# EasyEDA Pro project ProProject_Open Energy Box_2024-07-22.epro, schematic Schematic, sheets 1 to 7 of 12

## Sheets
1 CM4: Create Date: 2024-05-25; Page Name: CM4; Project Name: Open Energy Box; Schematic Name: Schematic; Update Date: 2024-05-25; Company: Connect IQ; Drawed: Rafal Pernal; Page Size: A4; Part Number: JLCPCB-002; Reviewed: EasyEDA Pro; Version: V0.1
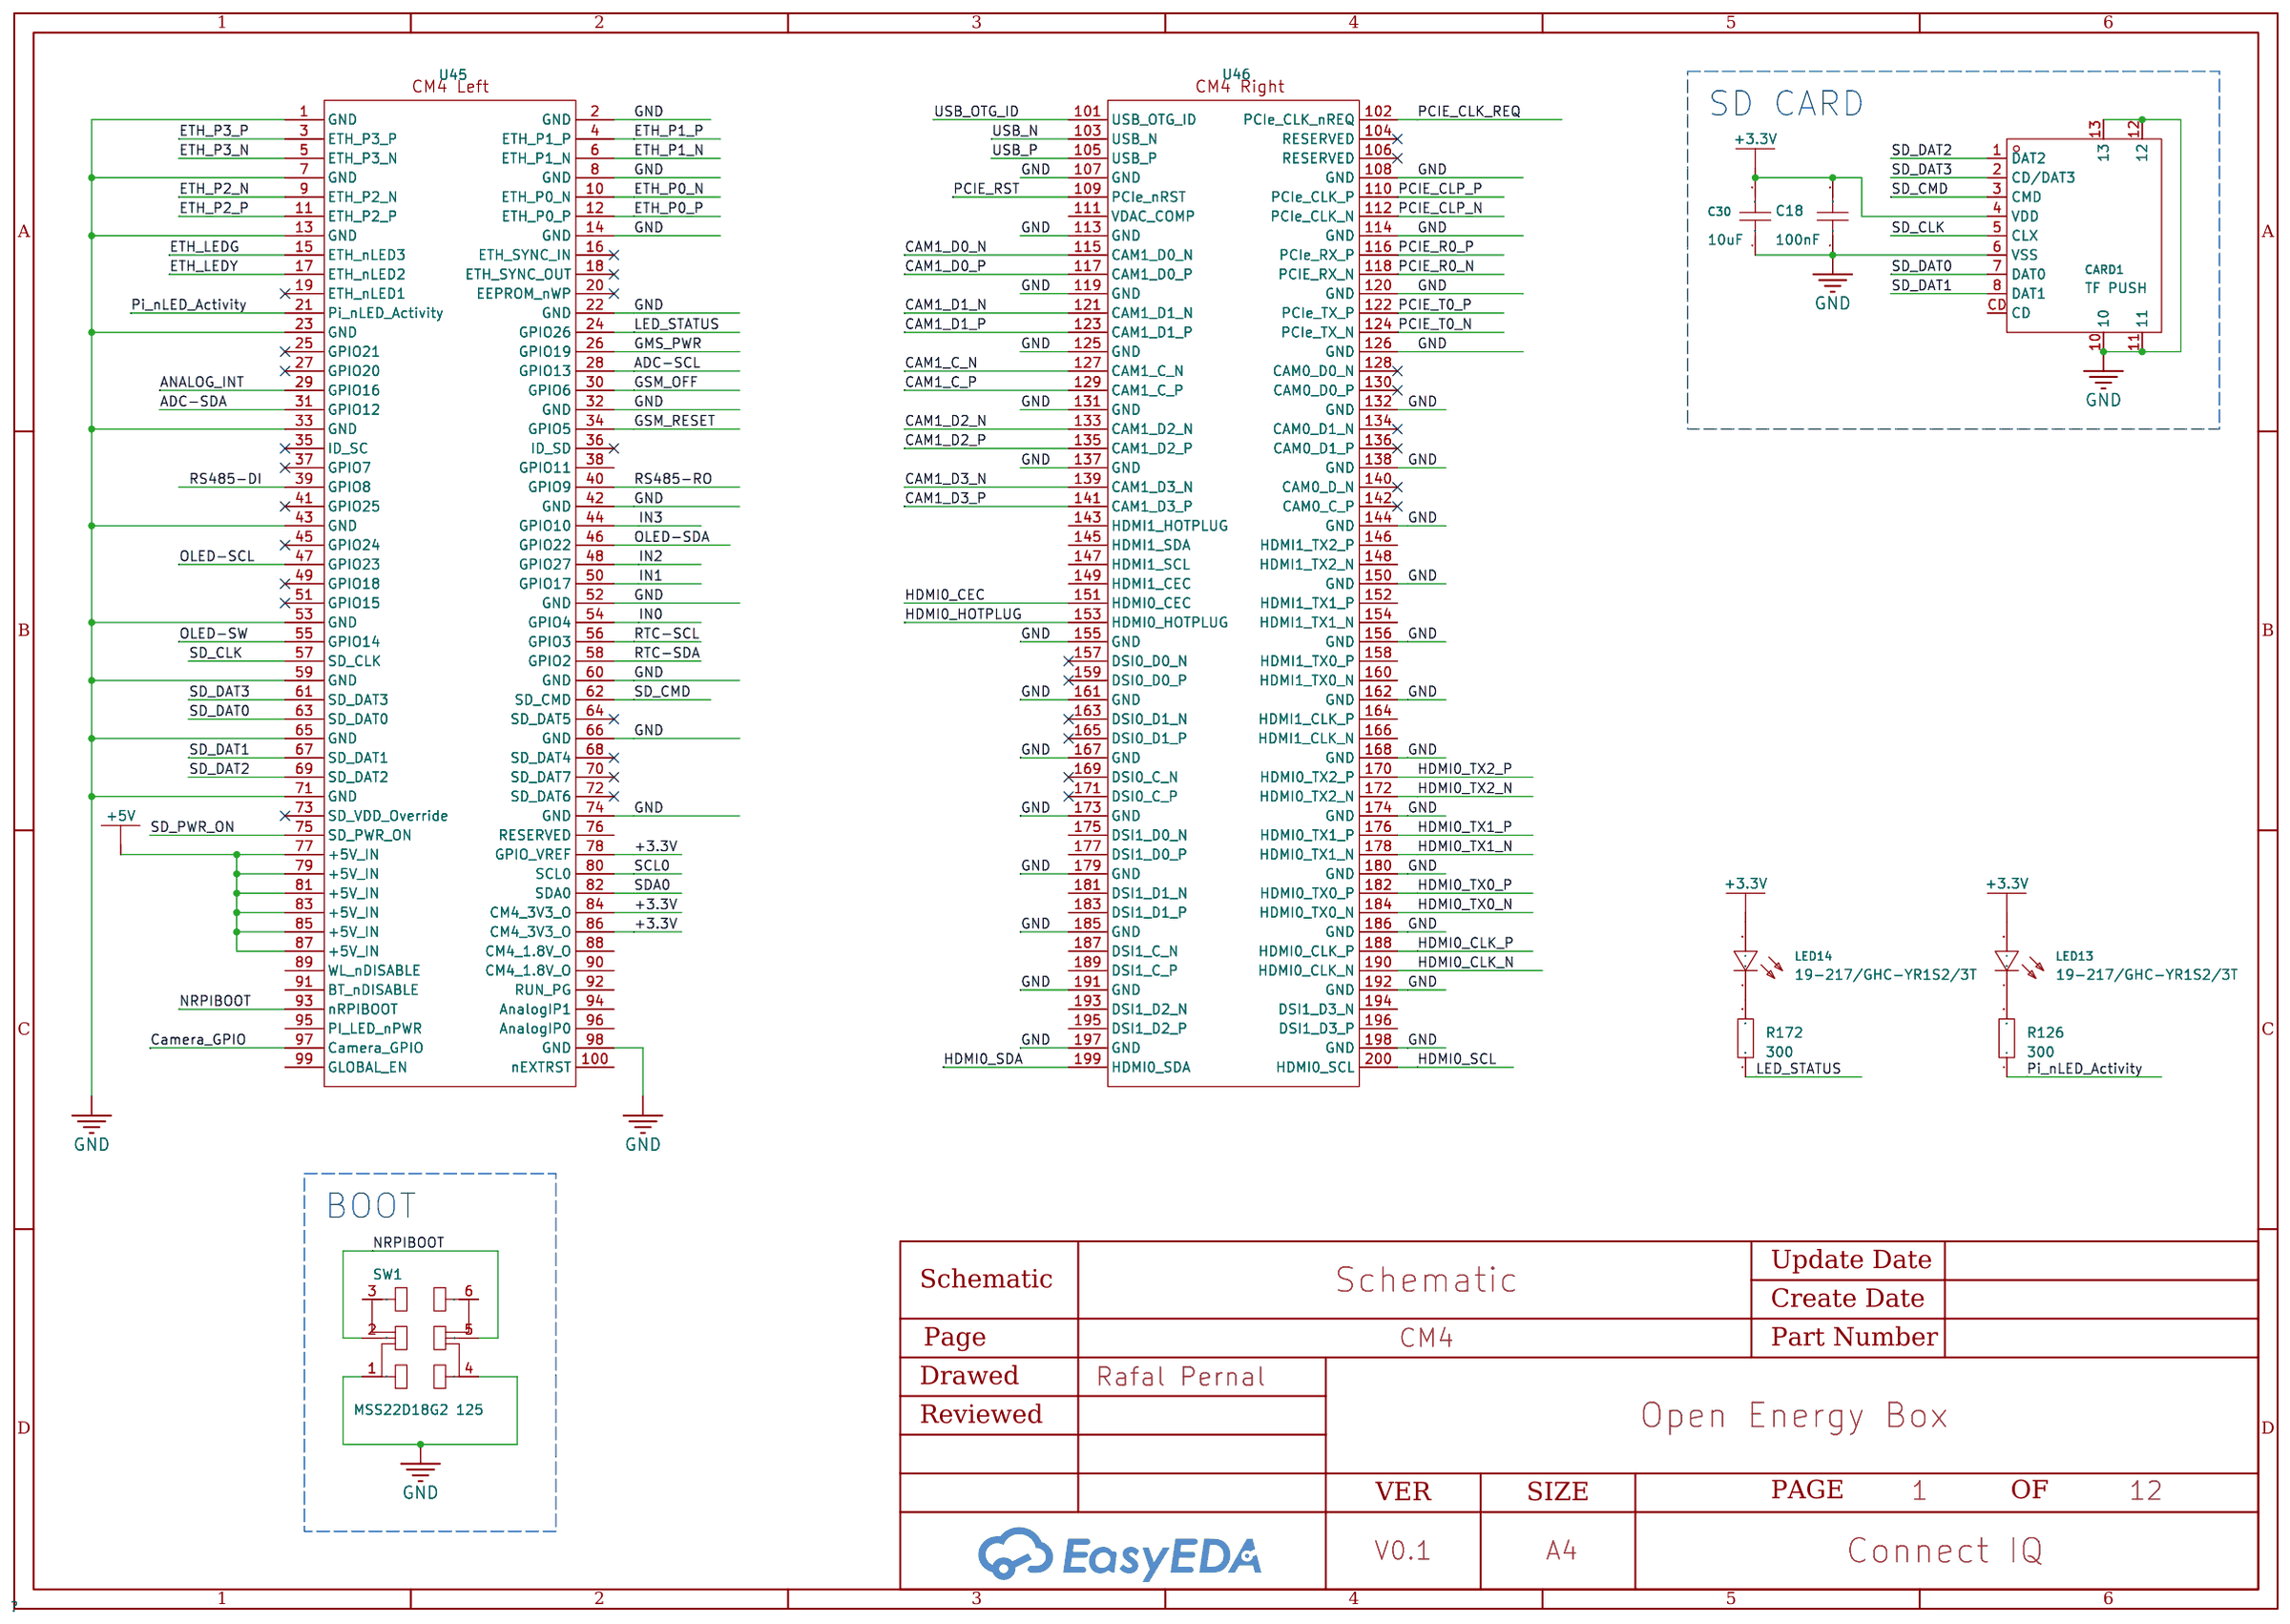
[diagram p0: CM4]
2 GSM: Page Name: GSM
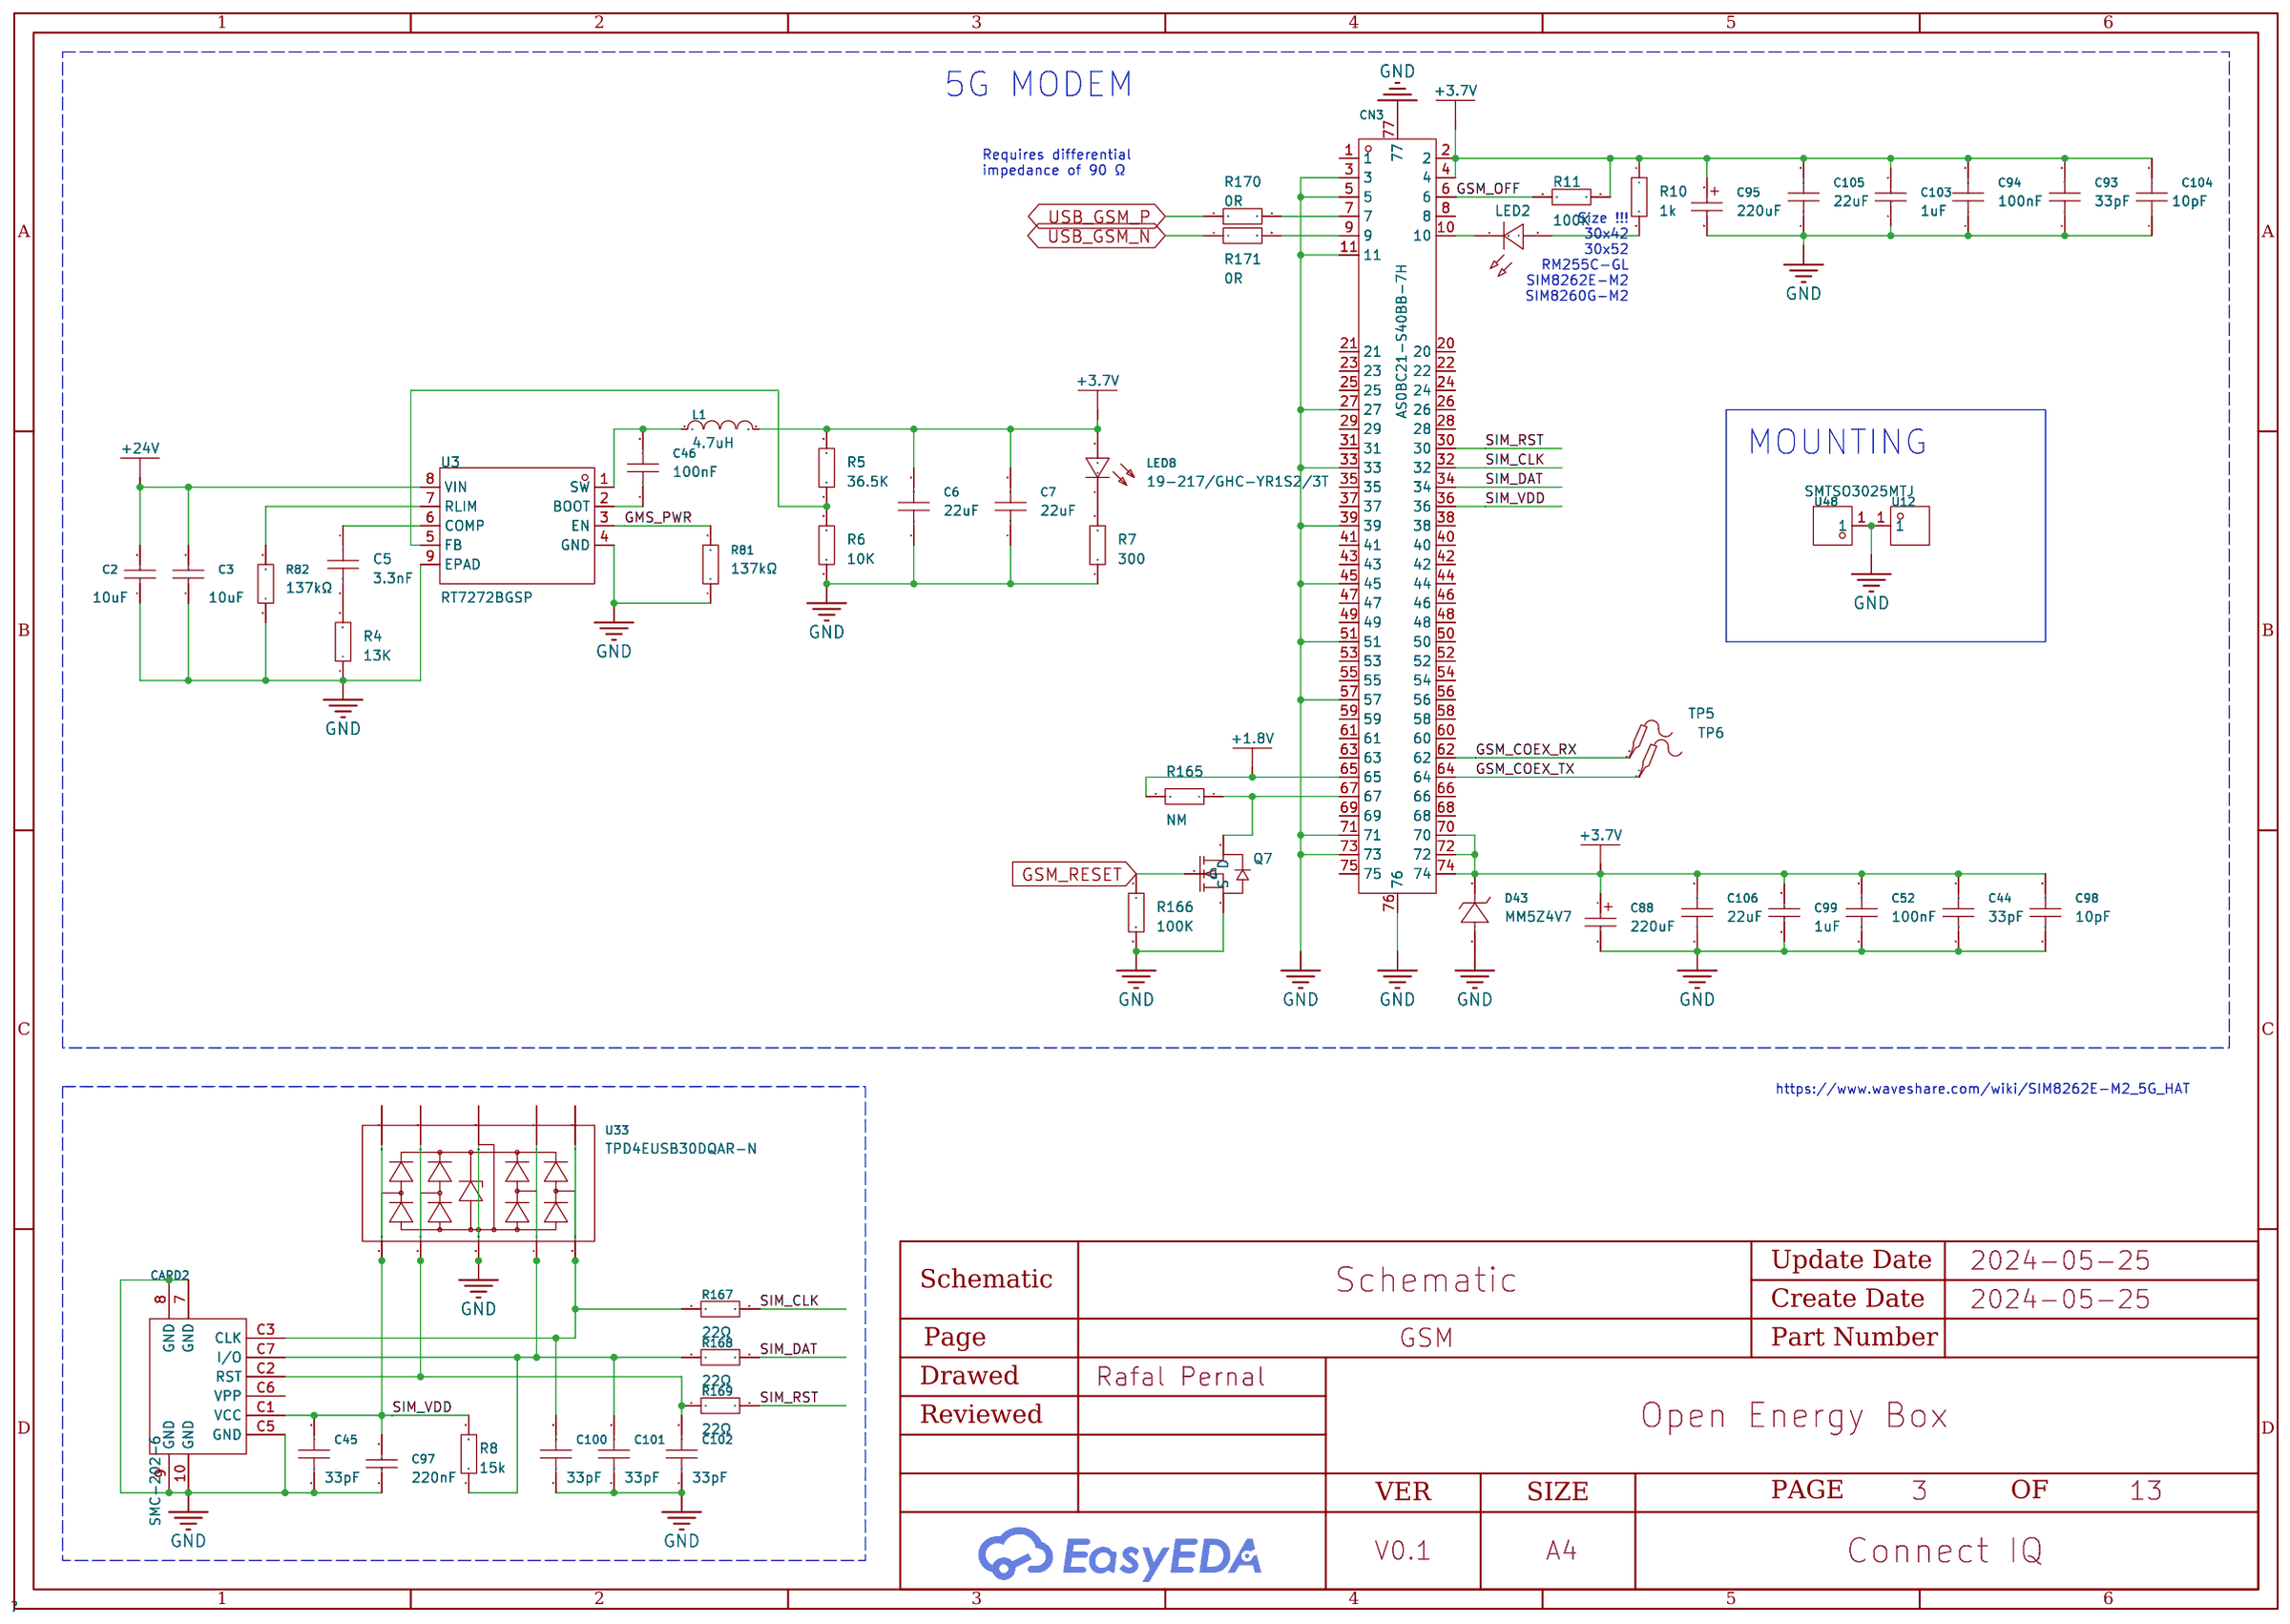
[diagram p1: GSM]
3 SSD: Page Name: SSD
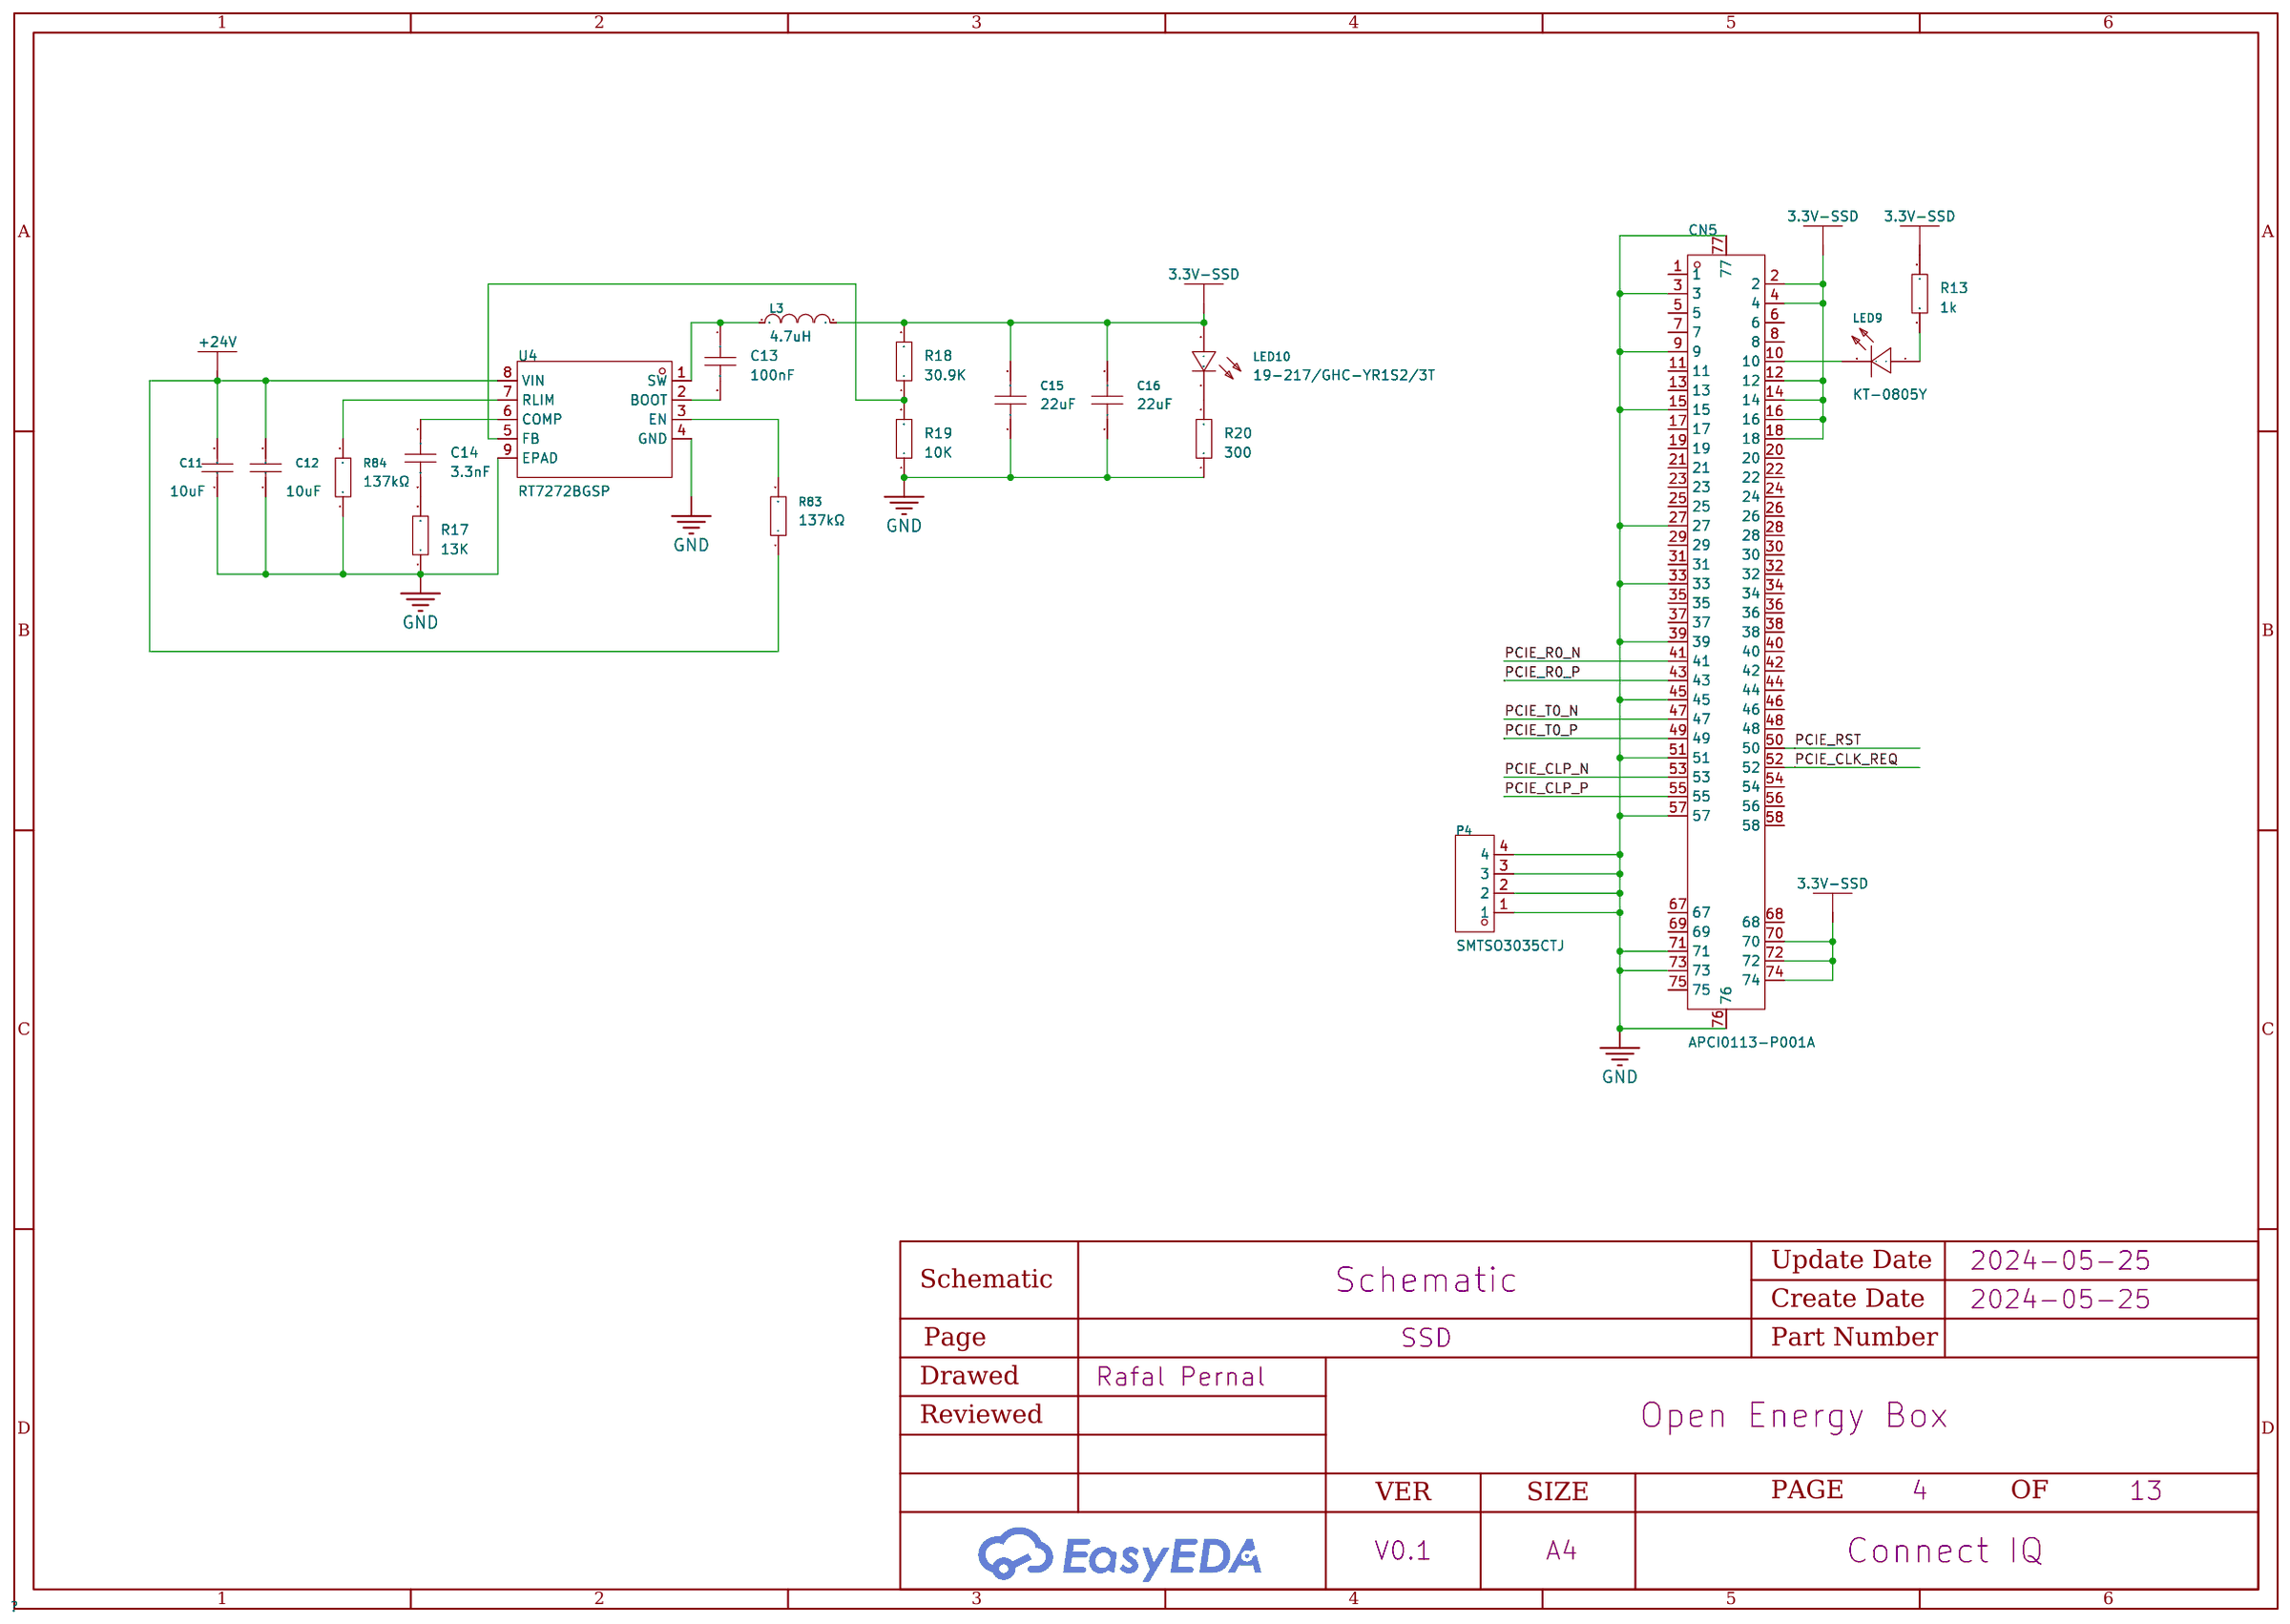
[diagram p2: SSD]
4 CAM_DIS: Page Name: CAM_DIS
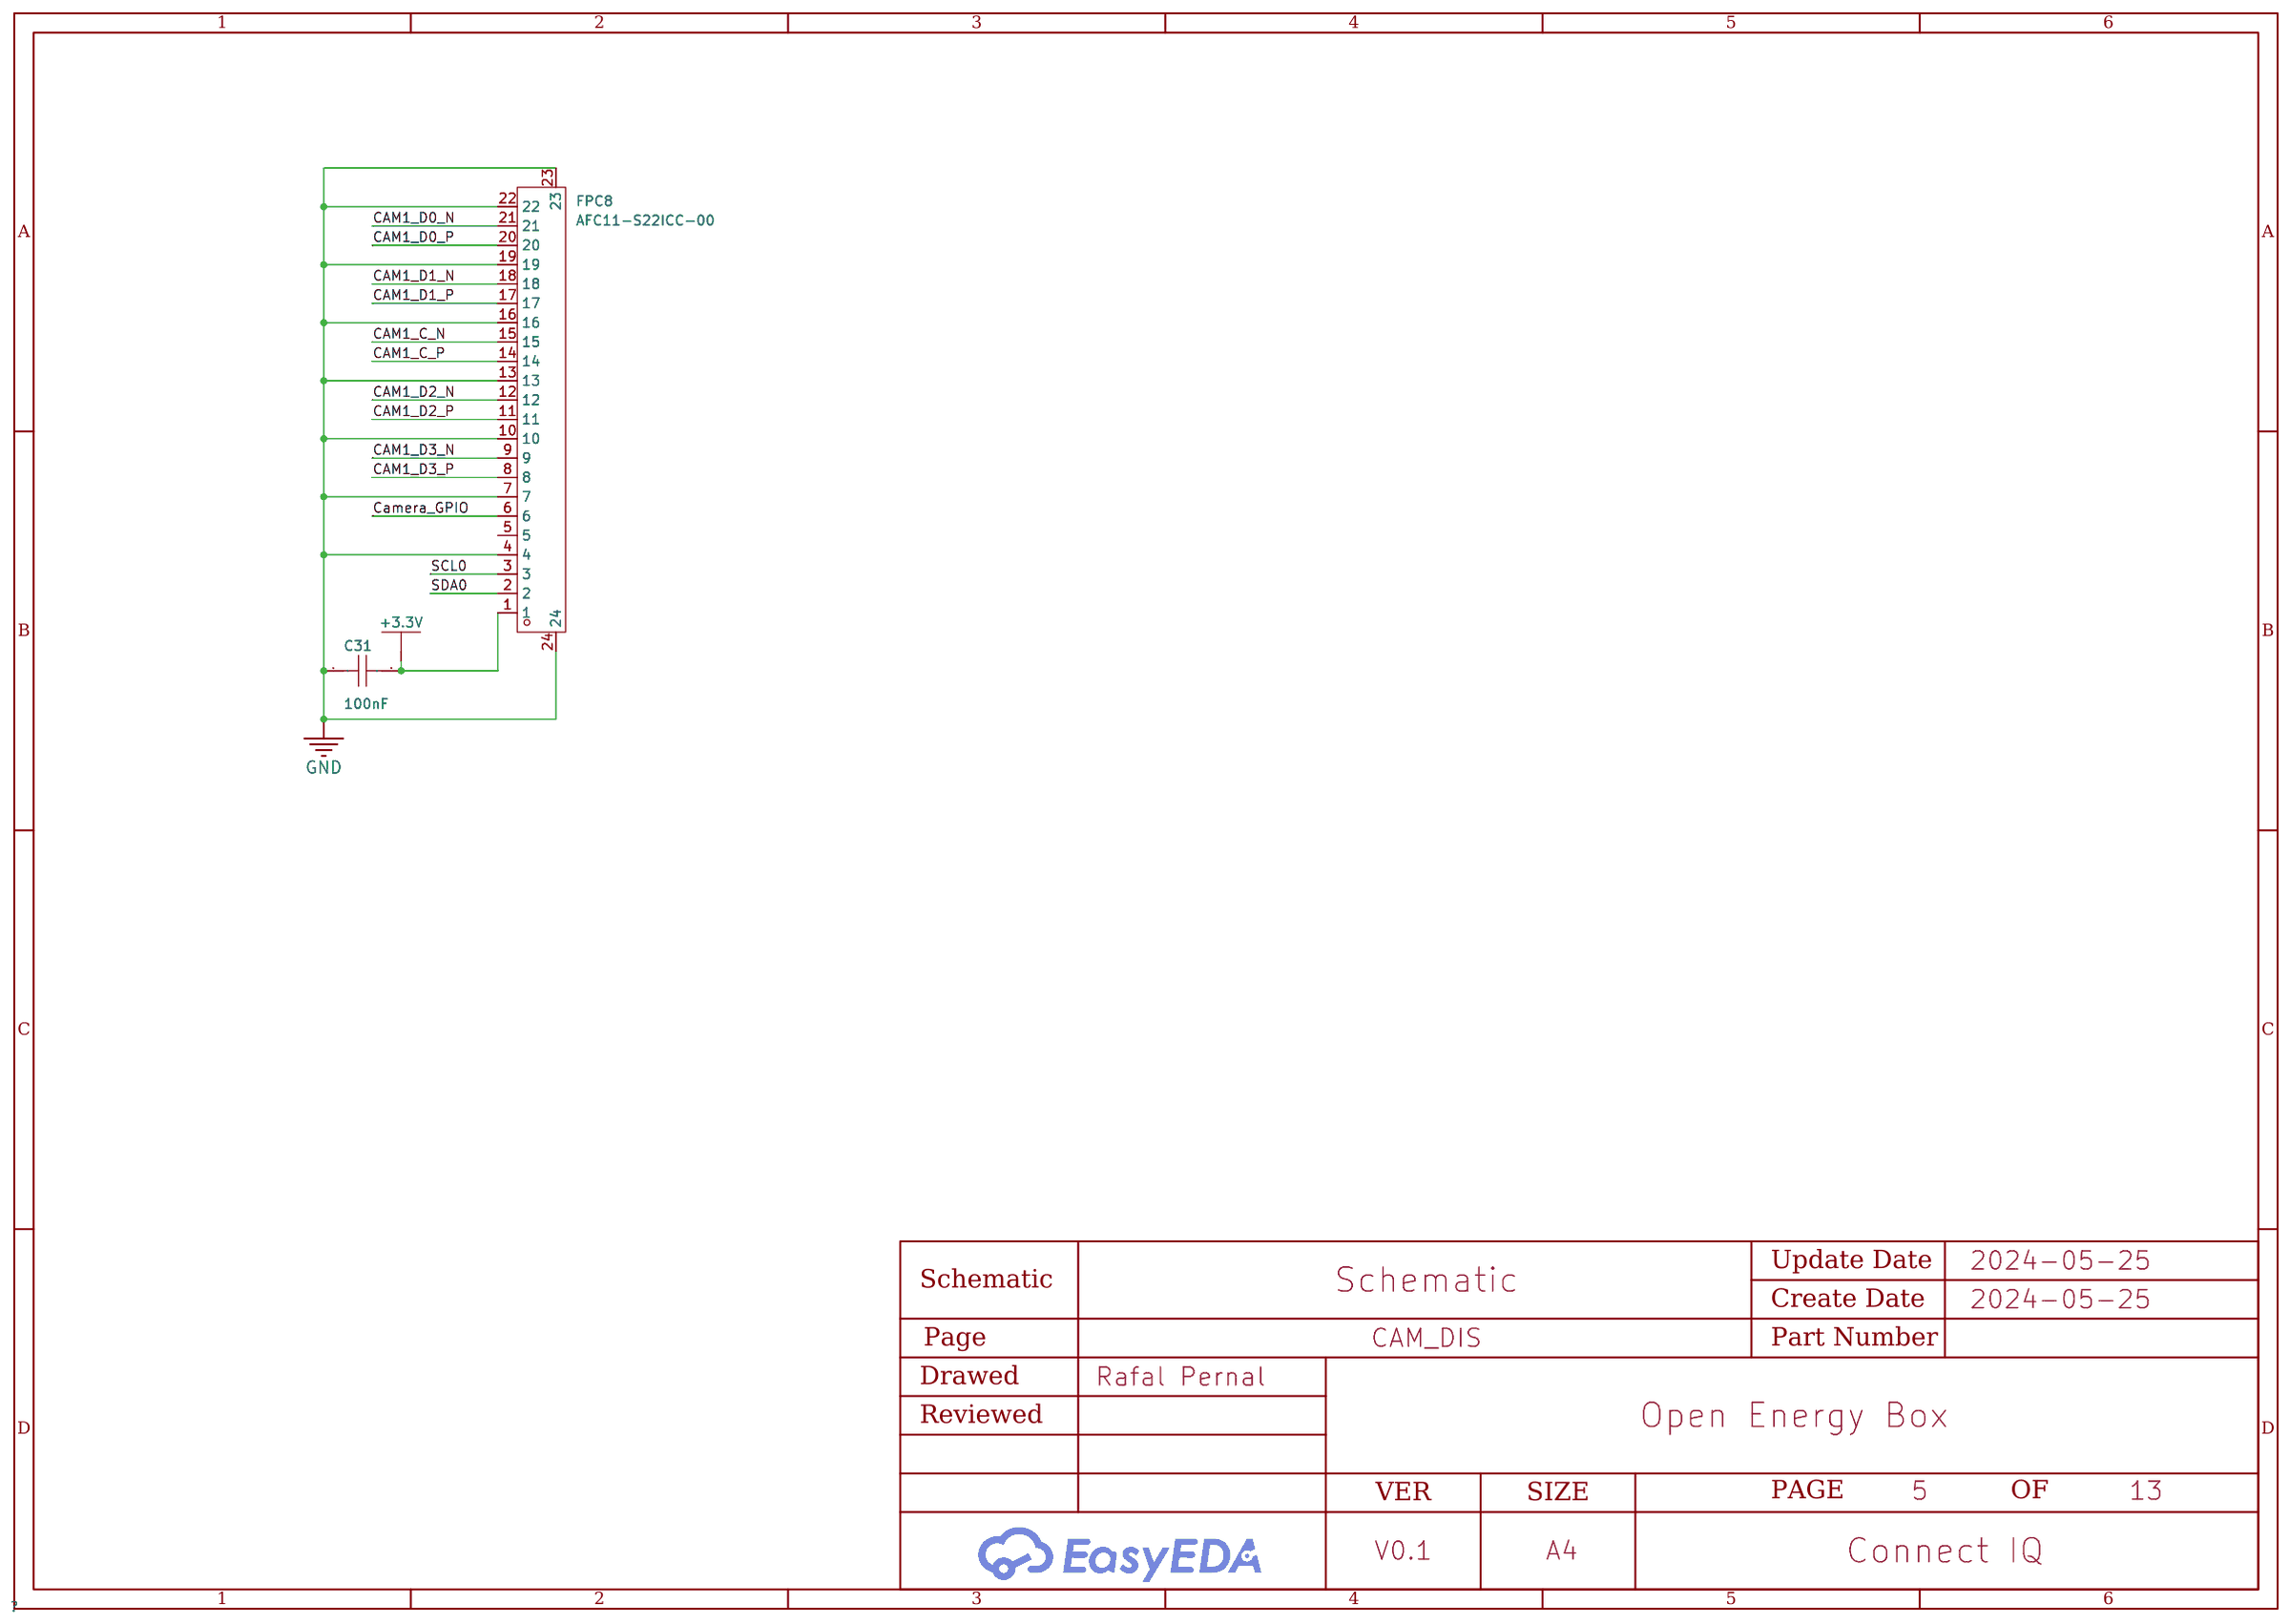
[diagram p3: CAM_DIS]
5 ANALOG: Page Name: ANALOG; Drawed: EasyEDA Pro
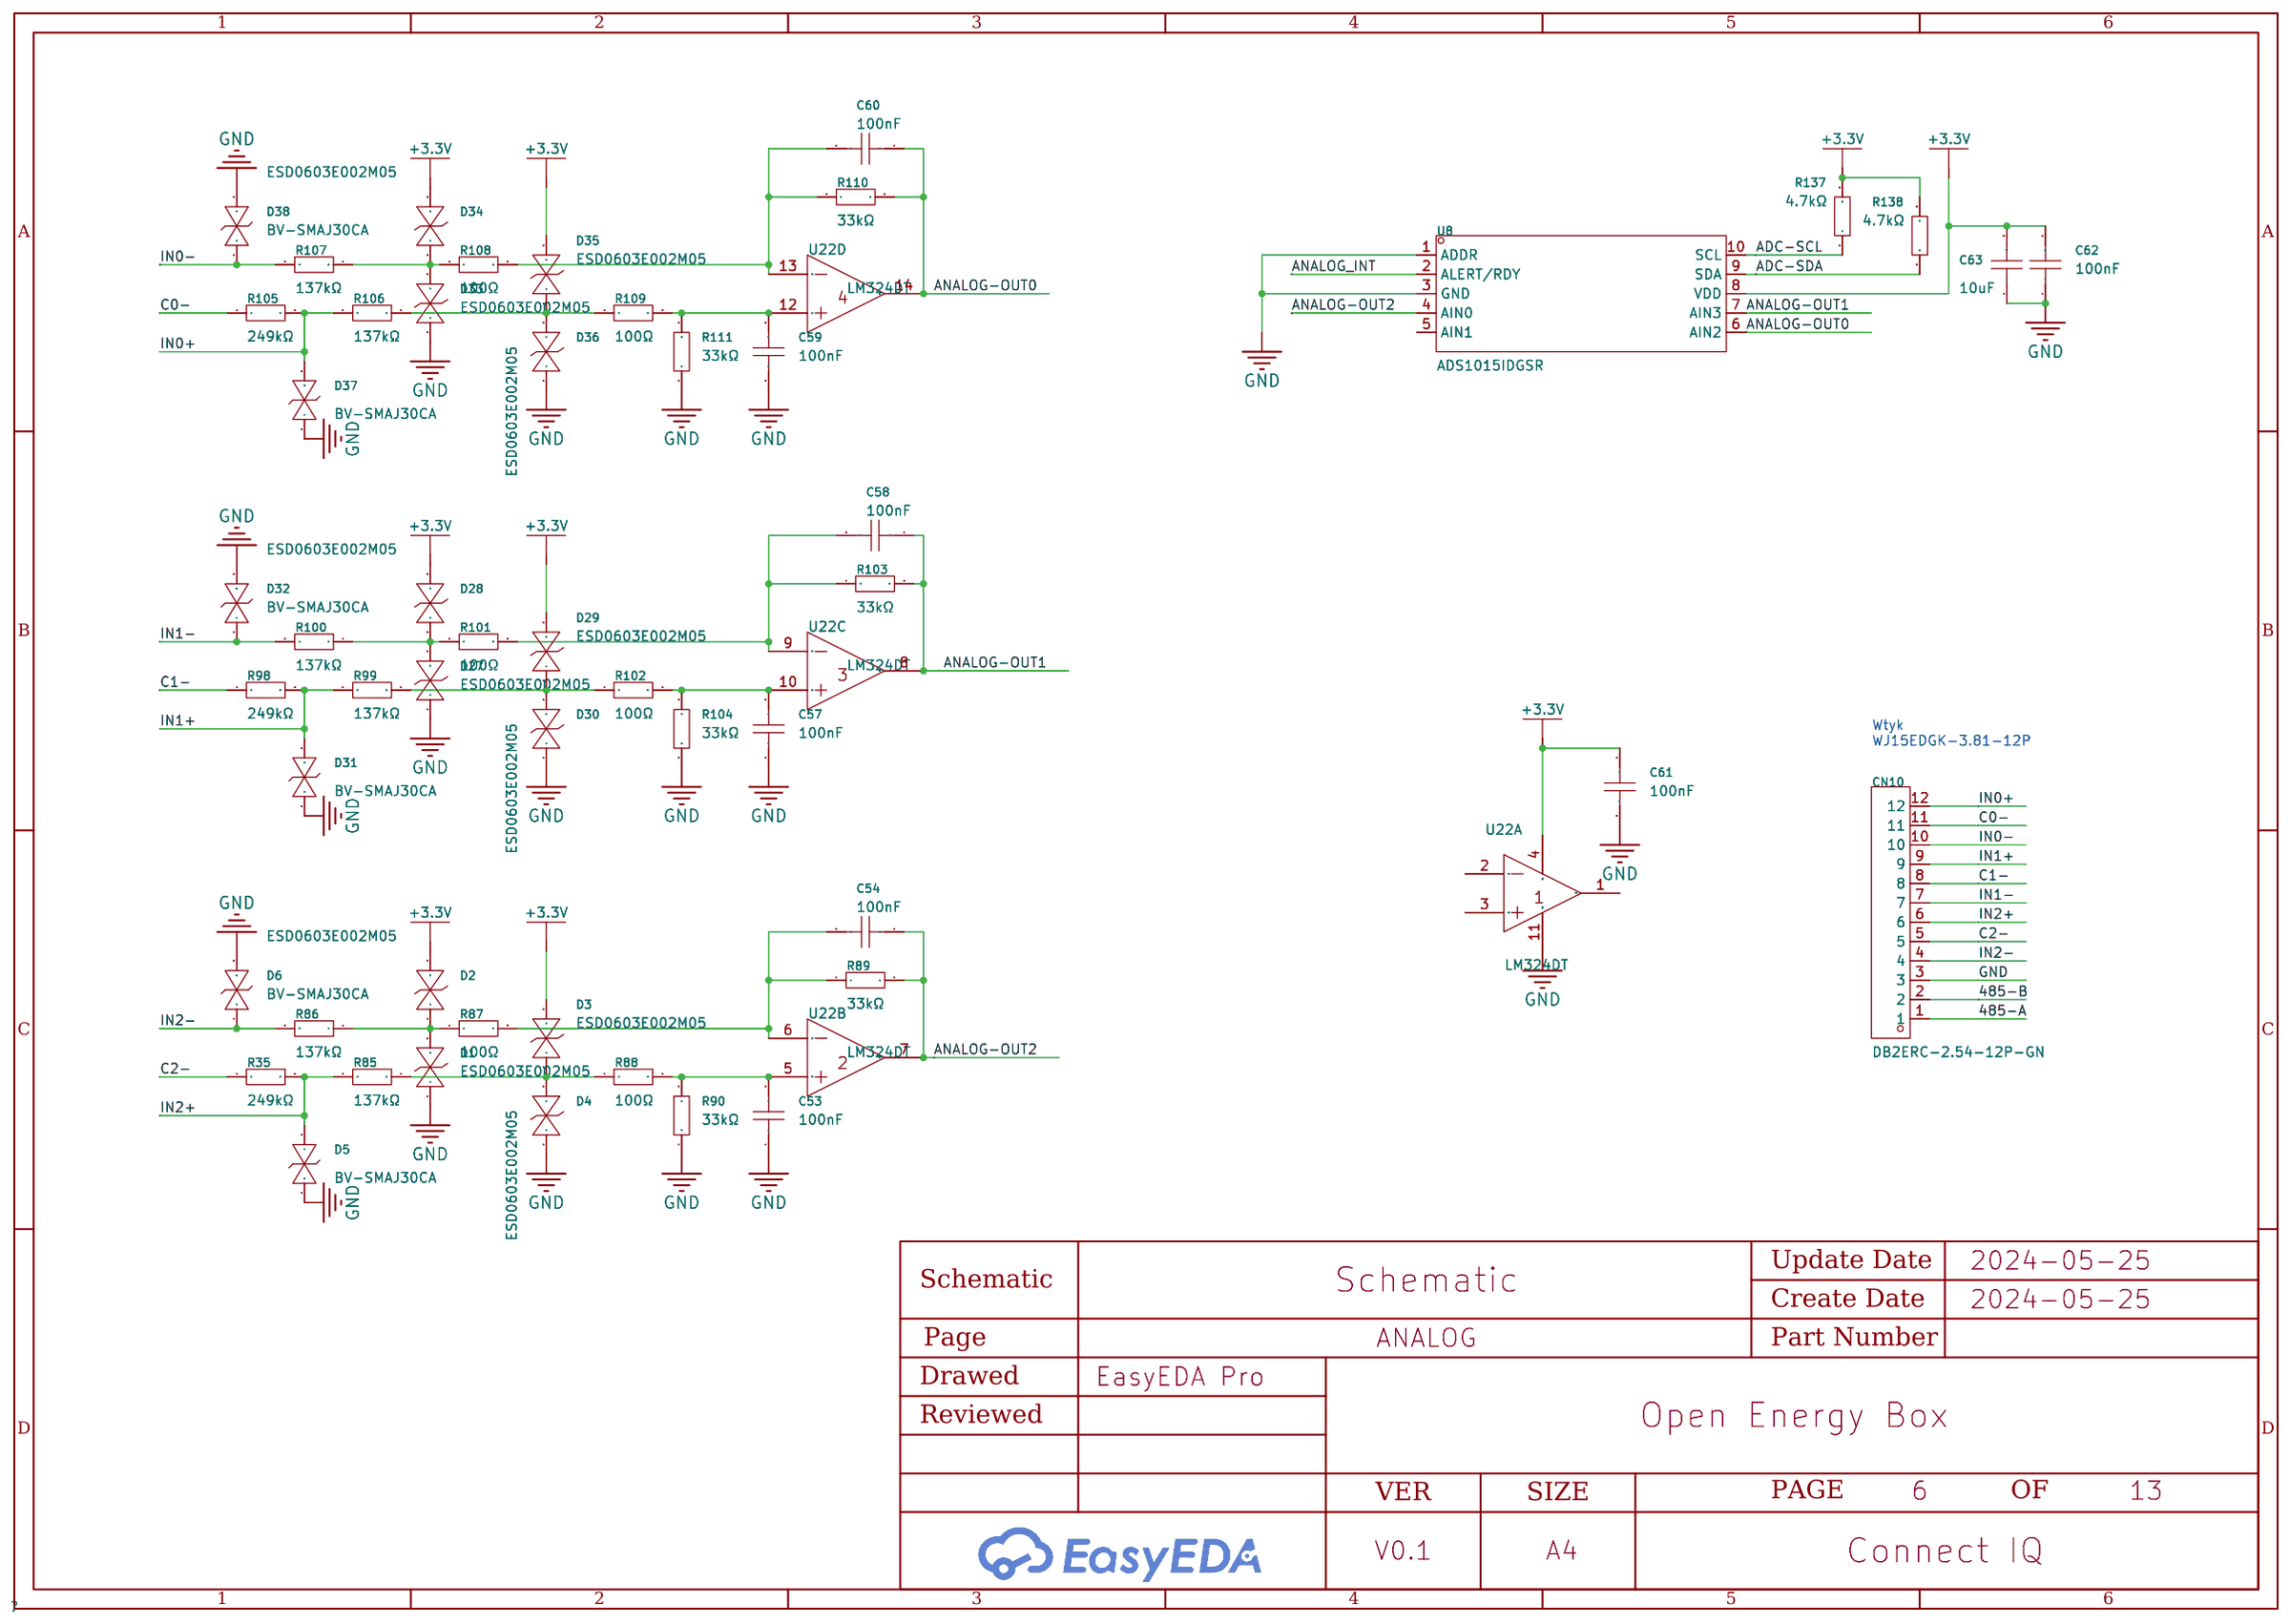
[diagram p4: ANALOG]
6 INPUTS: Page Name: INPUTS
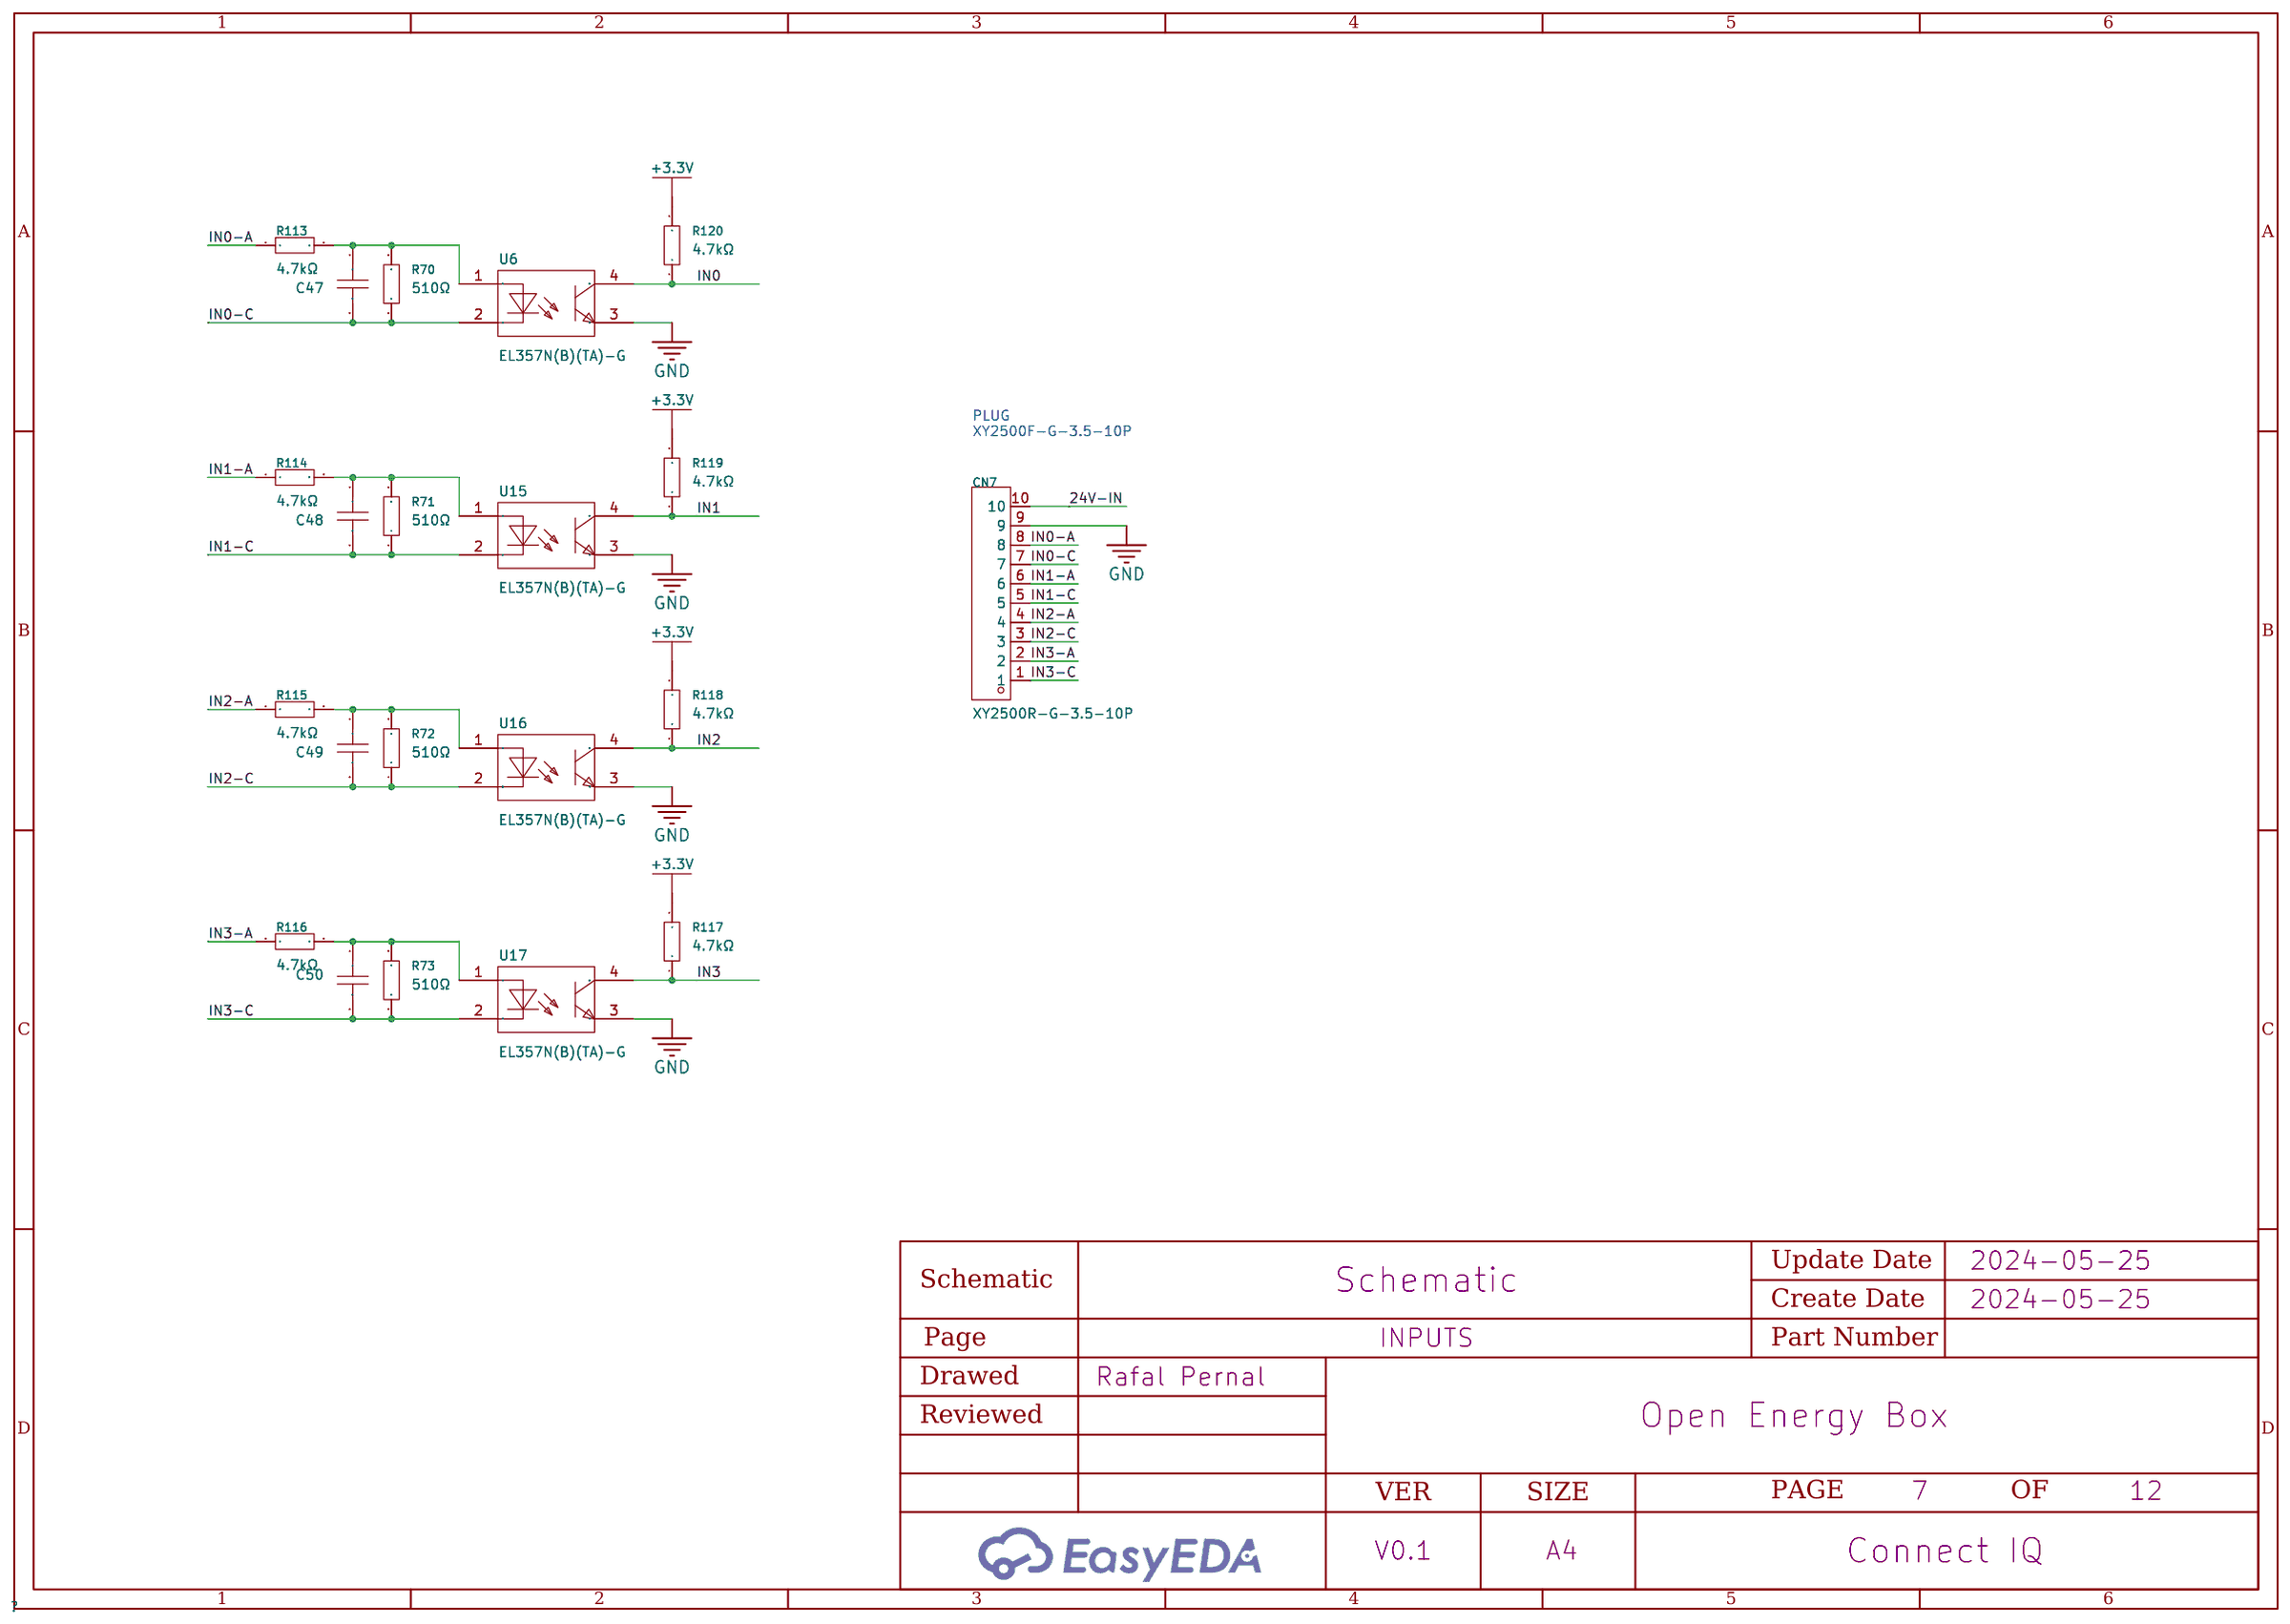
[diagram p5: INPUTS]
7 USB: Page Name: USB
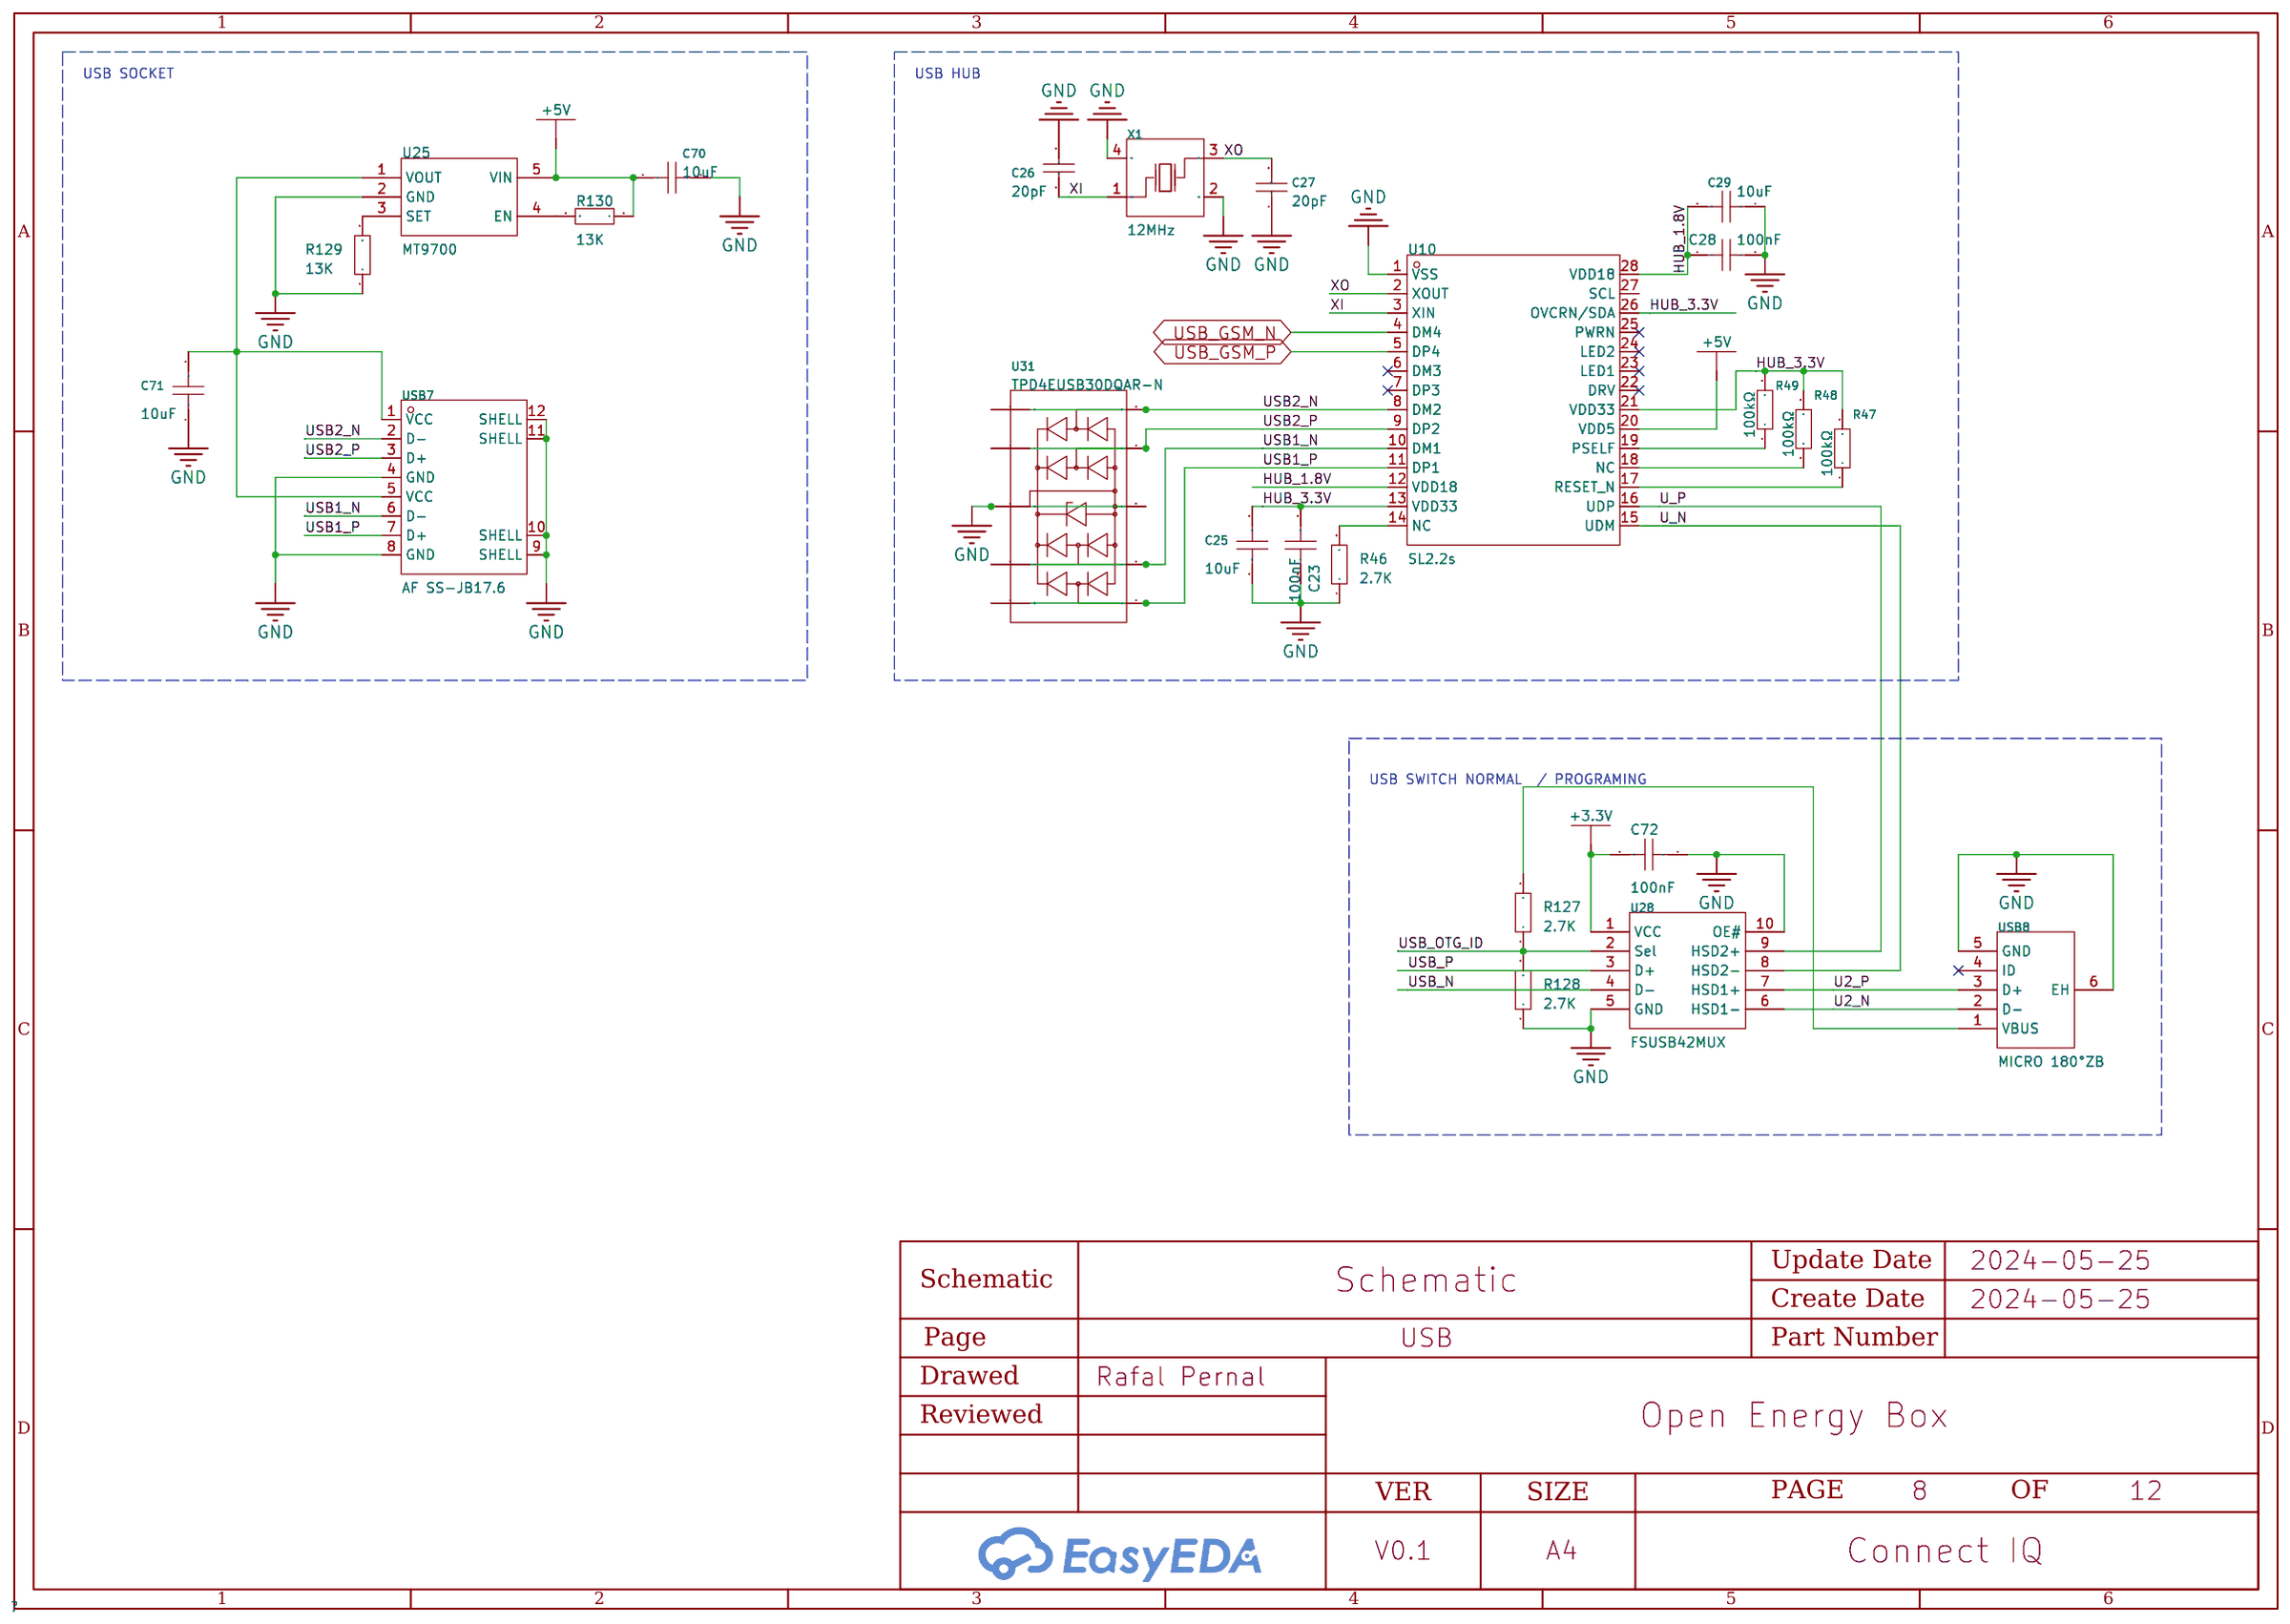
[diagram p6: USB]

## Parts
sheet ANALOG
C53  100nF  [C0603]
C54  100nF  [C0603]
C57  100nF  [C0603]
C58  100nF  [C0603]
C59  100nF  [C0603]
C60  100nF  [C0603]
C61  100nF  [C0603]
C62  100nF  [C0603]
C63  10uF  [C0603]
CN10  DB2ERC-2.54-12P-GN  [CONN-TH_12P-P2.54_DIBO_DB2ERC-2.54-12P-GN]
D1  ESD0603E002M05  [D0603-BI]
D2  ESD0603E002M05  [D0603-BI]
D3  ESD0603E002M05  [D0603-BI]
D4  ESD0603E002M05  [D0603-BI]
D5  BV-SMAJ30CA  [SMA_L4.4-W2.6-LS5.0-BI]
D6  BV-SMAJ30CA  [SMA_L4.4-W2.6-LS5.0-BI]
D27  ESD0603E002M05  [D0603-BI]
D28  ESD0603E002M05  [D0603-BI]
D29  ESD0603E002M05  [D0603-BI]
D30  ESD0603E002M05  [D0603-BI]
D31  BV-SMAJ30CA  [SMA_L4.4-W2.6-LS5.0-BI]
D32  BV-SMAJ30CA  [SMA_L4.4-W2.6-LS5.0-BI]
D33  ESD0603E002M05  [D0603-BI]
D34  ESD0603E002M05  [D0603-BI]
D35  ESD0603E002M05  [D0603-BI]
D36  ESD0603E002M05  [D0603-BI]
D37  BV-SMAJ30CA  [SMA_L4.4-W2.6-LS5.0-BI]
D38  BV-SMAJ30CA  [SMA_L4.4-W2.6-LS5.0-BI]
R35  249kΩ  [R1206]
R85  137kΩ  [R0603]
R86  137kΩ  [R0603]
R87  100Ω  [R0603]
R88  100Ω  [R0603]
R89  33kΩ  [R0603]
R90  33kΩ  [R0603]
R98  249kΩ  [R1206]
R99  137kΩ  [R0603]
R100  137kΩ  [R0603]
R101  100Ω  [R0603]
R102  100Ω  [R0603]
R103  33kΩ  [R0603]
R104  33kΩ  [R0603]
R105  249kΩ  [R1206]
R106  137kΩ  [R0603]
R107  137kΩ  [R0603]
R108  100Ω  [R0603]
R109  100Ω  [R0603]
R110  33kΩ  [R0603]
R111  33kΩ  [R0603]
R137  4.7kΩ  [R0603]
R138  4.7kΩ  [R0603]
U8  ADS1015IDGSR  [VSSOP-10_L3.0-W3.0-P0.50-LS4.9-BL]
U22  LM324DT  [SOIC-14_L8.7-W3.9-P1.27-LS6.0-BL]  (sections 1,2,3,4)
sheet CAM_DIS
C31  100nF  [C0603]
FPC8  AFC11-S22ICC-00  [FPC-SMD_22P-P1.00_AFC11-S22ICC-00]
sheet CM4
C18  100nF  [C0603]
C30  10uF  [C0603]
CARD1  TF PUSH  [TF-SMD_TF-PUSH]
LED13  19-217/GHC-YR1S2/3T  [LED0603-RD]
LED14  19-217/GHC-YR1S2/3T  [LED0603-RD]
R126  300  [R0603]
R172  300  [R0603]
SW1  MSS22D18G2 125  [SW-TH_SHOU_MSS22D18G2]
U45  CM4 Left  [CM4 LEFT]
U46  CM4 Right  [CM4 RIGHT]
sheet GSM
C2  10uF  [C1206]
C3  10uF  [C1206]
C5  3.3nF  [C0603]
C6  22uF  [C0805]
C7  22uF  [C0805]
C44  33pF  [C0603]
C45  33pF  [C0603]
C46  100nF  [C0603]
C52  100nF  [C0603]
C88  220uF  [CASE-B_3528]
C93  33pF  [C0603]
C94  100nF  [C0603]
C95  220uF  [CASE-B_3528]
C97  220nF  [C0603]
C98  10pF  [C0603]
C99  1uF  [C0603]
C100  33pF  [C0603]
C101  33pF  [C0603]
C102  33pF  [C0603]
C103  1uF  [C0603]
C104  10pF  [C0603]
C105  22uF  [C0805]
C106  22uF  [C0805]
CARD2  SMC-202-6  [SIM-SMD_SMC-202-6]
CN3  AS0BC21-S40BB-7H  [CONN-SMD_AS0BC21-S30BB-7H]
D43  MM5Z4V7  [SOD-523_L1.2-W0.8-LS1.6-FD]
L1  4.7uH  [IND-SMD_L7.1-W6.6]
LED2  -  [LED0603-R-RD]
LED8  19-217/GHC-YR1S2/3T  [LED0603-RD]
Q7  -  [SOT-23-3_L2.9-W1.3-P1.90-LS2.4-BR]
R4  13K  [R0603]
R5  36.5K  [R0603]
R6  10K  [R0603]
R7  300  [R0603]
R8  15k  [R0603]
R10  1k  [R0603]
R11  100K  [R0603]
R81  137kΩ  [R0603]
R82  137kΩ  [R0603]
R165  NM  [R0603]
R166  100K  [R0603]
R167  22Ω  [R0603]
R168  22Ω  [R0603]
R169  22Ω  [R0603]
R170  0R  [R0603]
R171  0R  [R0603]
TP5  -  [Test-Point-0.5mm]
TP6  -  [Test-Point-0.5mm]
U3  RT7272BGSP  [SOIC-8_L5.0-W4.0-P1.27-LS6.0-BL-EP2.0]
U12  SMTSO3025MTJ  [SMD_SMTSO3060CTJ]
U33  TPD4EUSB30DQAR-N  [DFN-10_L2.5-W1.0-P0.50-BL-A]
U48  SMTSO3025MTJ  [SMD_SMTSO3060CTJ]
sheet INPUTS
C47  100nF  [C0603]
C48  100nF  [C0603]
C49  100nF  [C0603]
C50  100nF  [C0603]
CN7  XY2500R-G-3.5-10P  [CONN-TH_XY2500R-G-3.5-10P]
R70  510Ω  [R0603]
R71  510Ω  [R0603]
R72  510Ω  [R0603]
R73  510Ω  [R0603]
R113  4.7kΩ  [R0603]
R114  4.7kΩ  [R0603]
R115  4.7kΩ  [R0603]
R116  4.7kΩ  [R0603]
R117  4.7kΩ  [R0603]
R118  4.7kΩ  [R0603]
R119  4.7kΩ  [R0603]
R120  4.7kΩ  [R0603]
U6  EL357N(B)(TA)-G  [OPTO-SMD-4_L4.4-W4.1-P2.54-LS7.0-TL]
U15  EL357N(B)(TA)-G  [OPTO-SMD-4_L4.4-W4.1-P2.54-LS7.0-TL]
U16  EL357N(B)(TA)-G  [OPTO-SMD-4_L4.4-W4.1-P2.54-LS7.0-TL]
U17  EL357N(B)(TA)-G  [OPTO-SMD-4_L4.4-W4.1-P2.54-LS7.0-TL]
sheet SSD
C11  10uF  [C1206]
C12  10uF  [C1206]
C13  100nF  [C0603]
C14  3.3nF  [C0603]
C15  22uF  [C0805]
C16  22uF  [C0805]
CN5  APCI0113-P001A  [CONN-SMD_APCI0113-P001A]
L3  4.7uH  [IND-SMD_L7.1-W6.6]
LED9  KT-0805Y  [LED0805-R-RD]
LED10  19-217/GHC-YR1S2/3T  [LED0603-RD]
P4  SMTSO3035CTJ  [SMD_BD5.6-D4.1]
R13  1k  [R0603]
R17  13K  [R0603]
R18  30.9K  [R0603]
R19  10K  [R0603]
R20  300  [R0603]
R83  137kΩ  [R0603]
R84  137kΩ  [R0603]
U4  RT7272BGSP  [SOIC-8_L5.0-W4.0-P1.27-LS6.0-BL-EP2.0]
sheet USB
C23  100nF  [C0603]
C25  10uF  [C0603]
C26  20pF  [C0603]
C27  20pF  [C0603]
C28  100nF  [C0603]
C29  10uF  [C0603]
C70  10uF  [C0603]
C71  10uF  [C0603]
C72  100nF  [C0603]
R46  2.7K  [R0603]
R47  100kΩ  [R0603]
R48  100kΩ  [R0603]
R49  100kΩ  [R0603]
R127  2.7K  [R0603]
R128  2.7K  [R0603]
R129  13K  [R0603]
R130  13K  [R0603]
U10  SL2.2s  [SSOP-28_L9.9-W3.9-P0.64-LS6.0-BL]
U25  MT9700  [SOT-23-5_L3.0-W1.7-P0.95-LS2.8-BR]
U28  FSUSB42MUX  [MSOP-10_L3.0-W3.0-P0.50-LS5.0-BL]
U31  TPD4EUSB30DQAR-N  [DFN-10_L2.5-W1.0-P0.50-BL-A]
USB7  AF SS-JB17.6  [USB-A-TH_AF-SS-JB17.6]
USB8  MICRO 180°ZB  [MICRO-USB-TH_MICRO-180-ZB]
X1  12MHz  [OSC-SMD_4P-L3.2-W2.5-BL]

## Library data of the parts
C44-C46 C52-C54 C57-C62 C93 C94 C98 C100-C102 C104 = CC0603KRX7R9BB104: Capacitance: Tolerance:±10% Tolerance:±10% Voltage Rated: Temperature Coefficient:; LCSC Part Name: 100nF ±10% 50V; Supplier Part: C14663; Manufacturer: YAGEO(国巨); Supplier Footprint: 0603; JLCPCB Part Class: Basic Part; Datasheet: https://atta.szlcsc.com/upload/public/pdf/source/20180910/C282072_33301C7F631E79921B82A8DAC6BCC5B3.pdf; Supplier: LCSC; Tolerance: ±10%
C25 C29 C30 C63 C70 C71 = CL10A106KP8NNNC: Capacitance: Tolerance:±10% Tolerance:±10% Voltage Rated: Temperature Coefficient:; LCSC Part Name: 10uF ±10% 10V; Supplier Part: C19702; Manufacturer: SAMSUNG(三星); Supplier Footprint: 0603; JLCPCB Part Class: Basic Part; Datasheet: https://atta.szlcsc.com/upload/public/pdf/source/20160218/1457707763339.pdf; Supplier: LCSC; Tolerance: ±10%
CN10 = DB2ERC-2.54-12P-GN: Connector Type:板端/Receptacle-Close Pitch:2.54mm Structure:1x12P Number of Rows:1 Number of PINs Per Row:12 Number of Pins:12P Current Rating (Max):5A Voltage Rating (Max):150V Contact Material:Copper Alloy Contact Plating:Tin Operating Temperature Range:-; LCSC Part Name: 2.54mm 1x12P 排数:1 每排P数:12; Supplier Part: C2927512; Manufacturer: DIBO(地博电气); Supplier Footprint: 弯插,P=2.54mm; JLCPCB Part Class: Extended Part; Datasheet: https://atta.szlcsc.com/upload/public/pdf/source/20230321/910C409D9BDC2B7494BE314CD29A7494.pdf; Supplier: LCSC; Connector Type: 板端/Receptacle-Close; Pitch: 2.54mm; Structure: 1x12P; Number of Rows: 1; Number of PINs Per Row: 12; Number of Pins: 12P; Current Rating (Max): 5A; Voltage Rating (Max): 150V; Contact Material: Copper Alloy; Contact Plating: Tin; Operating Temperature Range: -40℃~+105℃; Color: Green; Mounting Style: Bend
D1-D4 D27-D30 D33-D36 = ESD0603E002M05: Supplier Part: C727179; Manufacturer: TWGMC(台湾迪嘉); Supplier Footprint: 0603; JLCPCB Part Class: Extended Part; Datasheet: https://atta.szlcsc.com/upload/public/pdf/source/20200827/C727179_89543CBBA629D7A8E1F2B7FF70E0FB60.pdf; Supplier: LCSC
D5 D6 D31 D32 D37 D38 = BV-SMAJ30CA: Supplier Part: C883201; Manufacturer: Bencent(槟城); Supplier Footprint: SMA(DO-214AC); JLCPCB Part Class: Extended Part; Datasheet: https://atta.szlcsc.com/upload/public/pdf/source/20201016/C883201_1813CF94EA8180A7637B4007E3FADB07.pdf; Supplier: LCSC
R35 R98 R105 = RTT062493FTP: Type:Thick Film Resistors Resistance: Tolerance:±1% Tolerance:±1% Power(Watts): Overload Voltage (Max): Temperature Coefficient:±100ppm/℃ Temperature Coefficient:±100ppm/℃ Operating Temperature Range:-55℃~+155℃ Operating Temperature Range:-55℃~+155℃; LCSC Part Name: 厚膜电阻 249kΩ ±1% 250mW; Supplier Part: C104719; Manufacturer: RALEC(旺诠); Supplier Footprint: 1206; JLCPCB Part Class: Extended Part; Datasheet: https://atta.szlcsc.com/upload/public/pdf/source/20191219/C158410_884373A5B7E1BC76BF57BC45A946C093.pdf; Supplier: LCSC; Type: Thick Film Resistors; Tolerance: ±1%; Temperature Coefficient: ±100ppm/℃; Operating Temperature Range: -55℃~+155℃
R81-R86 R99 R100 R106 R107 = 0603WAF1373T5E: Resistance:137000Ω Tolerance:±1% Tolerance:±1% Power(Watts): Overload Voltage (Max): Temperature Coefficient:±100ppm/℃ Temperature Coefficient:±100ppm/℃ Type:Thick Film Resistors Operating Temperature Range:-55℃~+155℃ Operating Temperature Range:-55℃~+155; LCSC Part Name: 137kΩ ±1% 100mW 厚膜电阻; Supplier Part: C22872; Manufacturer: UNI-ROYAL(厚声); Supplier Footprint: 0603; JLCPCB Part Class: Extended Part; Datasheet: https://atta.szlcsc.com/upload/public/pdf/source/20200306/C422600_1E6D84923E4A46A82E41ADD87F860B5C.pdf; Supplier: LCSC; Tolerance: ±1%; Temperature Coefficient: ±100ppm/℃; Type: Thick Film Resistors; Operating Temperature Range: -55℃~+155℃
R87 R88 R101 R102 R108 R109 = 0603WAF1000T5E: Resistance: Tolerance:±1% Tolerance:±1% Power(Watts): Overload Voltage (Max): Temperature Coefficient:±200ppm/℃ Temperature Coefficient:±200ppm/℃ Type:Thick Film Resistors Operating Temperature Range:-55℃~+155℃ Operating Temperature Range:-55℃~+155℃; LCSC Part Name: 100Ω ±1% 100mW 厚膜电阻; Supplier Part: C22775; Manufacturer: UNI-ROYAL(厚声); Supplier Footprint: 0603; JLCPCB Part Class: Basic Part; Datasheet: https://atta.szlcsc.com/upload/public/pdf/source/20200306/C422600_1E6D84923E4A46A82E41ADD87F860B5C.pdf; Supplier: LCSC; Tolerance: ±1%; Temperature Coefficient: ±200ppm/℃; Type: Thick Film Resistors; Operating Temperature Range: -55℃~+155℃
R89 R90 R103 R104 R110 R111 = 0603WAF3302T5E: Resistance:33000Ω Tolerance:±1% Tolerance:±1% Power(Watts): Overload Voltage (Max): Temperature Coefficient:±100ppm/℃ Temperature Coefficient:±100ppm/℃ Type:Thick Film Resistors Operating Temperature Range:-55℃~+155℃ Operating Temperature Range:-55℃~+155℃; LCSC Part Name: 33kΩ ±1% 100mW 厚膜电阻; Supplier Part: C4216; Manufacturer: UNI-ROYAL(厚声); Supplier Footprint: 0603; JLCPCB Part Class: Basic Part; Datasheet: https://atta.szlcsc.com/upload/public/pdf/source/20200306/C422600_1E6D84923E4A46A82E41ADD87F860B5C.pdf; Supplier: LCSC; Tolerance: ±1%; Temperature Coefficient: ±100ppm/℃; Type: Thick Film Resistors; Operating Temperature Range: -55℃~+155℃
R113-R120 R137 R138 = 0603WAF4701T5E: Resistance:4700Ω Tolerance:±1% Tolerance:±1% Power(Watts): Overload Voltage (Max): Temperature Coefficient:±100ppm/℃ Temperature Coefficient:±100ppm/℃ Type:Thick Film Resistors Operating Temperature Range:-55℃~+155℃ Operating Temperature Range:-55℃~+155℃; LCSC Part Name: 4.7kΩ ±1% 100mW 厚膜电阻; Supplier Part: C23162; Manufacturer: UNI-ROYAL(厚声); Supplier Footprint: 0603; JLCPCB Part Class: Basic Part; Datasheet: https://atta.szlcsc.com/upload/public/pdf/source/20200306/C422600_1E6D84923E4A46A82E41ADD87F860B5C.pdf; Supplier: LCSC; Tolerance: ±1%; Temperature Coefficient: ±100ppm/℃; Type: Thick Film Resistors; Operating Temperature Range: -55℃~+155℃
U8 = ADS1015IDGSR: Supplier Part: C193969; Manufacturer: TI(德州仪器); Supplier Footprint: VSSOP-10-0.5mm; JLCPCB Part Class: Extended Part; Datasheet: https://www.ti.com/cn/lit/gpn/ads1015; Supplier: LCSC
U22 = LM324DT: Amplifier Type:General Purpose Number of Circuits: Gain Bandwidth Product（GBP）: Slew Rate（SR）: Output Type: Supply Voltage（Single）: Iq per channel (Typ): Operating Temperature:; Supplier Part: C71035; Manufacturer: ST(意法半导体); Supplier Footprint: SOIC-14_150mil; JLCPCB Part Class: Basic Part; Datasheet: https://atta.szlcsc.com/upload/public/pdf/source/20160408/1460100649718.pdf; Supplier: LCSC; Amplifier Type: General Purpose
C5 C13 C14 C18 C23 C28 C31 C47-C50 C72 = CAP_0603: Supplier Footprint: 0603
FPC8 = AFC11-S22ICC-00_C11074: Pitch:0.5mm Number of Contacts:22P Locking Feature:Slide Lock Mounting Type:Brick nogging Contact Type:单侧触点/Vertical Height Above Board:4.4mm FFC, FCB Thickness:0.3mm~0.3mm FFC, FCB Thickness:0.3mm~0.3mm; LCSC Part Name: 0.5mm P数:22P 抽屉式 单侧触点/垂直; Supplier Part: C11074; Manufacturer: JS(钜硕电子); Supplier Footprint: SMD,P=0.5mm; JLCPCB Part Class: Extended Part; Datasheet: https://atta.szlcsc.com/upload/public/pdf/source/20191211/C466537_F6F2472ADACFFA77E875AFE9DAB8E0AD.pdf; Supplier: LCSC; Pitch: 0.5mm; Number of Contacts: 22P; Locking Feature: Slide Lock; Mounting Type: Brick nogging; Contact Type: 单侧触点/Vertical; Height Above Board: 4.4mm; FFC, FCB Thickness: 0.3mm~0.3mm
CARD1 = TF PUSH: Card Connection Mode:Self bomb Card Type:MicroSD卡(TF卡) Connector Type:Deck Maximum Body Height:2mm Operating Temperature Range:-20℃~+90℃ Operating Temperature Range:-20℃~+90℃; LCSC Part Name: 自弹式 MicroSD卡(TF卡) 卡座 外焊式; Supplier Part: C393941; Manufacturer: SHOU HAN(首韩); Supplier Footprint: SMD; JLCPCB Part Class: Extended Part; Datasheet: https://atta.szlcsc.com/upload/public/pdf/source/20191011/C393941_0DDD896EE907FEB750D8B7B8982E2A67.pdf; Supplier: LCSC; Card Connection Mode: Self bomb; Card Type: MicroSD卡(TF卡); Connector Type: Deck; Maximum Body Height: 2mm; Operating Temperature Range: -20℃~+90℃
LED8 LED10 LED13 LED14 = 19-217/GHC-YR1S2/3T: Emitted Color:Emerald Diode Configuration:- Forward Voltage (VF):3.3V Forward Voltage (VF):3.3V Forward Current:20mA Power Dissipation:110mW Lens Color:无色透明透镜 Dominant Wavelength:520nm~535nm Dominant Wavelength:520nm~535nm Peak Wavelength:518nm Color Temp; LCSC Part Name: 翠绿; Supplier Part: C72043; Manufacturer: EVERLIGHT(亿光); Supplier Footprint: 0603; JLCPCB Part Class: Basic Part; Datasheet: https://atta.szlcsc.com/upload/public/pdf/source/20160507/1462613613780.pdf; Supplier: LCSC; Emitted Color: Emerald; Forward Voltage (VF): 3.3V; Forward Current: 20mA; Power Dissipation: 110mW; Lens Color: 无色透明透镜; Dominant Wavelength: 520nm~535nm; Peak Wavelength: 518nm; Luminous Intensity: 199mcd; Viewing Angle: 120°; Operating Temperature: -40℃~+85℃
R4-R8 R10 R11 R13 R17-R20 R46 R126-R130 R165 R166 R170-R172 = Res_0603: Supplier Footprint: 0603
SW1 = MSS22D18G2 125: Current Rating (DC):0.1A Voltage Rating (DC):12V Circuit:DPDT Mounting Style:Straight Mechanical Life:10000 Actuator Color:Black Pin Style:PCPin Operating Temperature:-25℃~+70℃ Operating Temperature:-25℃~+70℃; LCSC Part Name: 拨动开关/两档立式 6脚插件 柄长2.0mm 大六立插 9.1*3.5mm; Supplier Part: C2906278; Manufacturer: SHOU HAN(首韩); Supplier Footprint: 插件; JLCPCB Part Class: Extended Part; Datasheet: https://atta.szlcsc.com/upload/public/pdf/source/20211019/D4989EEEB5F6F0747E953BD44D956157.pdf; Supplier: LCSC; Current Rating (DC): 0.1A; Voltage Rating (DC): 12V; Circuit: DPDT; Mounting Style: Straight; Mechanical Life: 10000; Actuator Color: Black; Pin Style: PCPin; Operating Temperature: -25℃~+70℃
U45 = CM4 Left: Manufacturer: Hirose; Manufacturer Part: DF40HC(3.0)-100DS-0.4V(51); Supplier Part: C424649; Supplier: LCSC; link: https://lcsc.com/product-detail/presales_HRS-Hirose-HRS-DF40C-100DS-0-4V-51_C597931.html
U46 = CM4 Right: Manufacturer: Hirose; Manufacturer Part: DF40C-100DS-0.4V(51); Supplier Part: C597931; Supplier: LCSC
C2 C3 C11 C12 = CL31A106KBHNNNE: Capacitance: Tolerance:±10% Tolerance:±10% Voltage Rated: Temperature Coefficient:; LCSC Part Name: 10uF ±10% 50V; Supplier Part: C13585; Manufacturer: SAMSUNG(三星); Supplier Footprint: 1206; JLCPCB Part Class: Basic Part; Datasheet: https://atta.szlcsc.com/upload/public/pdf/source/20160218/1457707763339.pdf; Supplier: LCSC; Tolerance: ±10%
C6 C7 C15 C16 C105 C106 = CL21A226MAQNNNE_C45783: Capacitance: Tolerance:±20% Tolerance:±20% Voltage Rated: Temperature Coefficient:; LCSC Part Name: 22uF ±20% 25V; Supplier Part: C45783; Manufacturer: SAMSUNG(三星); Manufacturer Part: CL21A226MAQNNNE; Supplier Footprint: 0805; JLCPCB Part Class: Basic Part; Datasheet: https://atta.szlcsc.com/upload/public/pdf/source/20160218/1457707763339.pdf; Supplier: LCSC; Tolerance: ±20%
C88 C95 = TLJB227M006R0500: Capacitance: Tolerance:±20% Tolerance:±20% Rated Voltage: Equivalent Series Resistance(ESR):500mΩ@100kHz Operating Temperature:-55℃~+125℃ Operating Temperature:-55℃~+125℃; LCSC Part Name: 220uF ±20% 6.3V; Supplier Part: C30242; Manufacturer: Kyocera AVX; Supplier Footprint: CASE-B-3528; JLCPCB Part Class: Extended Part; Datasheet: https://atta.szlcsc.com/upload/public/pdf/source/20181016/C313517_95E099C94D57B8A6005DAF15C3058A23.pdf; Supplier: LCSC; Tolerance: ±20%; Equivalent Series Resistance(ESR): 500mΩ@100kHz; Operating Temperature: -55℃~+125℃
C97 = CL10B224KA8NNNC: Capacitance: Tolerance:±10% Tolerance:±10% Voltage Rated: Temperature Coefficient:; LCSC Part Name: 220nF ±10% 25V; Supplier Part: C21120; Manufacturer: SAMSUNG(三星); Supplier Footprint: 0603; JLCPCB Part Class: Basic Part; Datasheet: https://atta.szlcsc.com/upload/public/pdf/source/20160218/1457707763339.pdf; Supplier: LCSC; Tolerance: ±10%
C99 C103 = CL10A105KB8NNNC: Capacitance: Tolerance:±10% Tolerance:±10% Voltage Rated: Temperature Coefficient:; LCSC Part Name: 1uF ±10% 50V; Supplier Part: C15849; Manufacturer: SAMSUNG(三星); Supplier Footprint: 0603; JLCPCB Part Class: Basic Part; Datasheet: https://atta.szlcsc.com/upload/public/pdf/source/20160218/1457707763339.pdf; Supplier: LCSC; Tolerance: ±10%
CARD2 = SMC-202-6: Card Connection Mode:Self bomb Card Type:MicroSIM卡 Connector Type:Deck Body Height (Max):1.35mm Contact Material:C5191 Contact Plating:Gold Operating Temperature Range:-40℃~+85℃ Operating Temperature Range:-40℃~+85℃ Welding Temperature (Max):260℃; LCSC Part Name: 自弹式 MicroSIM卡 卡座 6P; Supplier Part: C266634; Manufacturer: XUNPU(讯普); Supplier Footprint: SMD; JLCPCB Part Class: Extended Part; Datasheet: https://atta.szlcsc.com/upload/public/pdf/source/20210906/4EE417A7320363AE91408A7279B36F10.pdf; Supplier: LCSC; Card Connection Mode: Self bomb; Card Type: MicroSIM卡; Connector Type: Deck; Body Height (Max): 1.35mm; Contact Material: C5191; Contact Plating: Gold; Operating Temperature Range: -40℃~+85℃; Welding Temperature (Max): 260℃
CN3 = AS0BC21-S40BB-7H: Connector Type:M.2 Pitch:0.5mm Number of Pins:67P Mounting Style:Surface Mount Height Above Board:4mm Operating Temperature Range:-40℃~+80℃ Operating Temperature Range:-40℃~+80℃; LCSC Part Name: M.2 0.5mm P数:67P; Supplier Part: C2761526; Manufacturer: FOXCONN(富士康); Supplier Footprint: SMD,P=0.5mm; JLCPCB Part Class: Extended Part; Datasheet: https://atta.szlcsc.com/upload/public/pdf/source/20210401/C2761526_27CB4EA38EB772E644A73C5FC833DA68.pdf; Supplier: LCSC; Connector Type: M.2; Pitch: 0.5mm; Number of Pins: 67P; Mounting Style: Surface Mount; Height Above Board: 4mm; Operating Temperature Range: -40℃~+80℃
D43 = MM5Z4V7: Diode Configuration:Single Zener Voltage (Nom):4.7V Reverse Leakage Current (Ir):2uA@1V Zener Voltage (Range):4.4V~5V Zener Voltage (Range):4.4V~5V Power Dissipation:200mW Zener Impedance (Zzt):80Ω Tolerance:- Tolerance:-; LCSC Part Name: MM5Z4V7 G8(G8表示丝印); Supplier Part: C2832571; Manufacturer: CBI(创基); Supplier Footprint: SOD-523; JLCPCB Part Class: Extended Part; Datasheet: https://atta.szlcsc.com/upload/public/pdf/source/20210520/C2832587_1FF830418C49D452CD1F70FB761C1A27.pdf; Supplier: LCSC; Diode Configuration: Single; Zener Voltage (Nom): 4.7V; Reverse Leakage Current (Ir): 2uA@1V; Zener Voltage (Range): 4.4V~5V; Power Dissipation: 200mW; Zener Impedance (Zzt): 80Ω
L1 L3 = CMLO0650H4R7MTT: Inductance: Tolerance:±20% Tolerance:±20% Rated Current: Type:屏蔽电感 DC Resistance (DCR):; LCSC Part Name: 4.7uH ±20%; Supplier Part: C439009; Manufacturer: Cybermax(思博科技); Supplier Footprint: SMD; JLCPCB Part Class: Extended Part; Datasheet: https://atta.szlcsc.com/upload/public/pdf/source/20191016/C439014_8EB8B87E5A293C2FB057F0008DFF1D19.pdf; Supplier: LCSC; Tolerance: ±20%; Type: 屏蔽电感
LED2 = LED_0603-B: Supplier Footprint: 0603
Q7 = N_MOS: Supplier Footprint: SOT-23
R167-R169 = 0603WAF220JT5E: Resistance:22000mΩ Tolerance:±1% Tolerance:±1% Power(Watts): Overload Voltage (Max): Temperature Coefficient:±100ppm/℃ Temperature Coefficient:±100ppm/℃ Type:Thick Film Resistors Operating Temperature Range:-55℃~+155℃ Operating Temperature Range:-55℃~+155; LCSC Part Name: 22Ω ±1% 100mW 厚膜电阻; Supplier Part: C23345; Manufacturer: UNI-ROYAL(厚声); Supplier Footprint: 0603; JLCPCB Part Class: Basic Part; Datasheet: https://atta.szlcsc.com/upload/public/pdf/source/20200306/C422600_1E6D84923E4A46A82E41ADD87F860B5C.pdf; Supplier: LCSC; Tolerance: ±1%; Temperature Coefficient: ±100ppm/℃; Type: Thick Film Resistors; Operating Temperature Range: -55℃~+155℃
TP5 TP6 = Test-Point: Test Point 测试点
U3 U4 = RT7272BGSP: Function:Step-down type Synchronous Rectification:- Number of Outputs:- Topology:- Input Voltage:- Input Voltage:- Output Current (Max):- Switching Frequency:-; LCSC Part Name: 降压型; Supplier Part: C127866; Manufacturer: RICHTEK(立锜); Supplier Footprint: SOIC-8-EP-150mil; JLCPCB Part Class: Extended Part; Datasheet: https://atta.szlcsc.com/upload/public/pdf/source/20180403/C127866_C96022CD8724BC3A1F23EF273B4658E0.pdf; Supplier: LCSC; Function: Step-down type
U12 U48 = SMTSO3025MTJ: LCSC Part Name: 雄和远景，电路板表贴圆螺母柱，M3X2.5，铁镀锡; Supplier Part: C2916364; Manufacturer: Sinhoo(雄和远景); JLCPCB Part Class: Extended Part; Datasheet: https://atta.szlcsc.com/upload/public/pdf/source/20211122/17CF5E24EB4D4DC090A80DE3D7DE5E21.pdf; Supplier: LCSC
U31 U33 = TPD4EUSB30DQAR-N: LCSC Part Name: TVS二极管(ESD); Supplier Part: C5148477; Manufacturer: BORN(伯恩半导体); Supplier Footprint: DFN-10L; JLCPCB Part Class: Extended Part; Datasheet: https://atta.szlcsc.com/upload/public/pdf/source/20220914/C5B302F271DD41F07FF0824DC250FA50.pdf; Supplier: LCSC
CN7 = XY2500R-G-3.5-10P: Connector Type:板端/Receptacle-Close Structure:1x10P Pitch:3.5mm Color:Green Mounting Style:Bend Number of Pins:10P Number of Rows:1 Number of PINs Per Row:10 Current Rating (Max):8A Voltage Rating (Max):300V Operating Temperature Range:- Operating Temperat; LCSC Part Name: 3.5mm 1x10P 排数:1 每排P数:10; Supplier Part: C880580; Manufacturer: XINLAIYA(新莱亚); Supplier Footprint: 弯插,P=3.5mm; JLCPCB Part Class: Extended Part; Datasheet: https://atta.szlcsc.com/upload/public/pdf/source/20201013/C880572_6BE3C892F898A2C15A6190F0C52877AF.pdf; Supplier: LCSC; Connector Type: 板端/Receptacle-Close; Structure: 1x10P; Pitch: 3.5mm; Color: Green; Mounting Style: Bend; Number of Pins: 10P; Number of Rows: 1; Number of PINs Per Row: 10; Current Rating (Max): 8A; Voltage Rating (Max): 300V
R70-R73 = 0603WAF5100T5E: Resistance: Tolerance:±1% Tolerance:±1% Power(Watts): Overload Voltage (Max): Temperature Coefficient:±100ppm/℃ Temperature Coefficient:±100ppm/℃ Type:Thick Film Resistors Operating Temperature Range:-55℃~+155℃ Operating Temperature Range:-55℃~+155℃; LCSC Part Name: 510Ω ±1% 100mW 厚膜电阻; Supplier Part: C23193; Manufacturer: UNI-ROYAL(厚声); Supplier Footprint: 0603; JLCPCB Part Class: Basic Part; Datasheet: https://atta.szlcsc.com/upload/public/pdf/source/20200306/C422600_1E6D84923E4A46A82E41ADD87F860B5C.pdf; Supplier: LCSC; Tolerance: ±1%; Temperature Coefficient: ±100ppm/℃; Type: Thick Film Resistors; Operating Temperature Range: -55℃~+155℃
U6 U15-U17 = EL357N(B)(TA)-G: Input voltage type:DC Output Type:光电三极管 Number of Outputs:1 Forward Voltage:1.2V Reverse Voltage:6V Output Current:50mA Receiving End Voltage:80V Collector-Emitter Saturation Voltage (Vce(sat)@Ic,IF):0.1V@1mA,20mA Rise time:3us@2mA,100Ω Fall time:4us@2mA,; LCSC Part Name: DC输入 隔离电压(rms):3750V; Supplier Part: C6649; Manufacturer: EVERLIGHT(亿光); Supplier Footprint: SOP-4-2.54mm; JLCPCB Part Class: Basic Part; Datasheet: https://atta.szlcsc.com/upload/public/pdf/source/20120405/1457706466151.pdf; Supplier: LCSC; Input voltage type: DC; Output Type: 光电三极管; Number of Outputs: 1; Forward Voltage: 1.2V; Reverse Voltage: 6V; Output Current: 50mA; Receiving End Voltage: 80V; Collector-Emitter Saturation Voltage (Vce(sat)@Ic,IF): 0.1V@1mA,20mA; Rise time: 3us@2mA,100Ω; Fall time: 4us@2mA,100Ω; Isolation Voltage(rms): 3750V; Operating Temperature: -55℃~+110℃
CN5 = APCI0113-P001A: Connector Type:M.2 Pitch:0.5mm Number of Pins:- Mounting Style:Surface Mount Height Above Board:4.8mm Operating Temperature Range:- Operating Temperature Range:-; LCSC Part Name: M.2 0.5mm; Supplier Part: C841669; Manufacturer: LOTES(嘉澤端子); Supplier Footprint: SMD; JLCPCB Part Class: Extended Part; Datasheet: https://atta.szlcsc.com/upload/public/pdf/source/20200922/C841669_9754B7102C4BA4979663435AF15FFBA0.pdf; Supplier: LCSC; Connector Type: M.2; Pitch: 0.5mm; Mounting Style: Surface Mount; Height Above Board: 4.8mm
LED9 = KT-0805Y: Emitted Color:Yellow Diode Configuration:- Forward Current:- Power Dissipation:- Lens Color:- Dominant Wavelength:- Dominant Wavelength:- Peak Wavelength:- Color Temperature:- Color Temperature:- Viewing Angle:- Mounting Sytle:- Operating Temperature:- Op; LCSC Part Name: 0805 黄灯 高亮; Supplier Part: C2296; Manufacturer: KENTO; Supplier Footprint: 0805; JLCPCB Part Class: Basic Part; Datasheet: https://atta.szlcsc.com/upload/public/pdf/source/20160421/1461205044170.pdf; Supplier: LCSC; Emitted Color: Yellow
P4 = SMTSO3035CTJ: LCSC Part Name: 雄和远景，电路板表贴圆螺母柱，M3X3.5，铜镀锡; Supplier Part: C2916333; Manufacturer: Sinhoo(雄和远景); JLCPCB Part Class: Extended Part; Datasheet: https://atta.szlcsc.com/upload/public/pdf/source/20211122/17CF5E24EB4D4DC090A80DE3D7DE5E21.pdf; Supplier: LCSC
C26 C27 = CL10C200JB8NNNC: Capacitance: Tolerance:±5% Tolerance:±5% Voltage Rated: Temperature Coefficient:; LCSC Part Name: 20pF ±5% 50V; Supplier Part: C1648; Manufacturer: SAMSUNG(三星); Supplier Footprint: 0603; JLCPCB Part Class: Basic Part; Datasheet: https://atta.szlcsc.com/upload/public/pdf/source/20160218/1457707763339.pdf; Supplier: LCSC; Tolerance: ±5%
R47-R49 = 0603WAF1003T5E: Resistance:100000Ω Tolerance:±1% Tolerance:±1% Power(Watts): Overload Voltage (Max): Temperature Coefficient:±100ppm/℃ Temperature Coefficient:±100ppm/℃ Type:Thick Film Resistors Operating Temperature Range:-55℃~+155℃ Operating Temperature Range:-55℃~+155; LCSC Part Name: 100kΩ ±1% 100mW 厚膜电阻; Supplier Part: C25803; Manufacturer: UNI-ROYAL(厚声); Supplier Footprint: 0603; JLCPCB Part Class: Basic Part; Datasheet: https://atta.szlcsc.com/upload/public/pdf/source/20200306/C422600_1E6D84923E4A46A82E41ADD87F860B5C.pdf; Supplier: LCSC; Tolerance: ±1%; Temperature Coefficient: ±100ppm/℃; Type: Thick Film Resistors; Operating Temperature Range: -55℃~+155℃
U10 = SL2.2s: Applications Function: Protocol:; Supplier Part: C2684434; Manufacturer: CoreChips(和芯润德); Supplier Footprint: SSOP-28-150mil; JLCPCB Part Class: Extended Part; Datasheet: https://atta.szlcsc.com/upload/public/pdf/source/20210326/C2684434_CAB530F8FA91F2F03D150623E20FCF34.pdf; Supplier: LCSC
U25 = MT9700: Supplier Part: C89855; Manufacturer: 西安航天民芯; Supplier Footprint: SOT-23-5; JLCPCB Part Class: Extended Part; Datasheet: https://atta.szlcsc.com/upload/public/pdf/source/20170418/1492481333031.pdf; Supplier: LCSC
U28 = FSUSB42MUX: LCSC Part Name: 小功率，两端口，高速 USB2.0 (480Mbps) 开关; Supplier Part: C11355; Manufacturer: onsemi(安森美); Supplier Footprint: MSOP-10; JLCPCB Part Class: Extended Part; Datasheet: https://atta.szlcsc.com/upload/public/pdf/source/20130225/1457706594597.pdf; Supplier: LCSC
USB7 = AF SS-JB17.6: Connector Type:Type-A Standard:USB 2.0 Gender:Female Number of Contacts:4P+4P Number of Ports:2 Mounting Style:Right-Angle Current Rating - Power (Max):1.5A Operating Temperature Range:-25℃~+85℃ Operating Temperature Range:-25℃~+85℃; LCSC Part Name: Type-A 母 弯插 双层白胶卷口有后盖,长度17.6MM; Supplier Part: C456021; Manufacturer: SHOU HAN(首韩); Supplier Footprint: 插件; JLCPCB Part Class: Extended Part; Datasheet: https://atta.szlcsc.com/upload/public/pdf/source/20191113/C456021_DAD2CFBF46E609FF6653446337360E6B.pdf; Supplier: LCSC; Connector Type: Type-A; Standard: USB 2.0; Gender: Female; Number of Contacts: 4P+4P; Number of Ports: 2; Mounting Style: Right-Angle; Current Rating - Power (Max): 1.5A; Operating Temperature Range: -25℃~+85℃
USB8 = MICRO 180°ZB: Connector Type:Micro-B Standard:USB 2.0 Gender:Female Number of Ports:1 Number of Contacts:5P Mounting Style:Straight Current Rating - Power (Max):1A Operating Temperature Range:-30℃~+80℃ Operating Temperature Range:-30℃~+80℃; LCSC Part Name: Micro-B 母 直插 平口; Supplier Part: C668588; Manufacturer: SHOU HAN(首韩); Supplier Footprint: 插件; JLCPCB Part Class: Extended Part; Datasheet: https://atta.szlcsc.com/upload/public/pdf/source/20200618/C668588_7F536DABFA33908FD042A0CFDA52C5F4.pdf; Supplier: LCSC; Connector Type: Micro-B; Standard: USB 2.0; Gender: Female; Number of Ports: 1; Number of Contacts: 5P; Mounting Style: Straight; Current Rating - Power (Max): 1A; Operating Temperature Range: -30℃~+80℃
X1 = X322512MSB4SI: Crystal Type:SMD Crystal Resonator Frequency: Load Capacitance: Frequency Tolerance:±10ppm Frequency Tolerance:±10ppm Frequency Stability:±30ppm Frequency Stability:±30ppm Operating Temperature: Operating Temperature:; LCSC Part Name: 12MHz ±10ppm 20pF YSX321SL; Supplier Part: C9002; Manufacturer: YXC(扬兴晶振); Supplier Footprint: SMD3225-4P; JLCPCB Part Class: Basic Part; Datasheet: https://atta.szlcsc.com/upload/public/pdf/source/20210329/C112971_1F611BDC486E193C1706F6D8EB5AA189.pdf; Supplier: LCSC; Crystal Type: SMD Crystal Resonator; Frequency Tolerance: ±10ppm; Frequency Stability: ±30ppm

## Nets
3.3V-SSD: C15.2 C16.2 CN5.2 CN5.4 CN5.12 CN5.14 CN5.16 CN5.18 CN5.70 CN5.72 CN5.74 L3.2 LED10.2(A) R13.1 R18.2
24V-IN: CN7.10 ; also on sheet 9
+1.8V: CN3.65 R165.2
+3.3V: C18.2 C30.2 C31.1 C61.1 C62.2 C63.2 C72.2 CARD1.4(VDD) D2.2 D3.2 D28.2 D29.2 D34.2 D35.2 FPC8.1 LED13.2(A) LED14.2(A) R117.2 R118.2 R119.2 R120.2 R137.2 R138.2 U8.8(VDD) U22.4(VCC+) U28.1(VCC) U45.78(GPIO_VREF) U45.84(CM4_3V3_O) U45.86(CM4_3V3_O) ; also on sheet 8 10 11
+3.7V: C6.2 C7.2 C44.2 C52.2 C88.1 C93.2 C94.2 C95.1 C98.2 C99.2 C103.2 C104.2 C105.2 C106.2 CN3.2 CN3.4 CN3.70 CN3.72 CN3.74 D43.2(K) L1.2 LED8.2(A) R5.2 R10.1 R11.1
+5V: C70.2 R130.1 U10.20(VDD5) U25.5(VIN) U45.77(+5V_IN) U45.79(+5V_IN) U45.81(+5V_IN) U45.83(+5V_IN) U45.85(+5V_IN) U45.87(+5V_IN) ; also on sheet 9 12
+24V: C2.2 C3.2 C11.2 C12.2 R83.1 U3.8(VIN) U4.8(VIN) ; also on sheet 9
GND: C2.1 C3.1 C6.1 C7.1 C11.1 C12.1 C15.1 C16.1 C18.1 C23.1 C25.1 C26.2 C27.1 C28.2 C29.1 C30.1 C31.2 C44.1 C45.1 C52.1 C53.1 C57.1 C59.1 C61.2 C62.1 C63.1 C70.1 C71.1 C72.1 C88.2 C93.1 C94.1 C95.2 C97.1 C98.1 C99.1 C100.1 C101.1 C102.1 C103.1 C104.1 C105.1 C106.1 CARD1.6(VSS) CARD1.10 CARD1.11 CARD1.12 CARD1.13 CARD2.7(GND) CARD2.8(GND) CARD2.9(GND) CARD2.10(GND) CARD2.C5(GND) CN3.3 CN3.5 CN3.11 CN3.27 CN3.33 CN3.39 CN3.45 CN3.51 CN3.57 CN3.71 CN3.73 CN3.76 CN3.77 CN5.3 CN5.9 CN5.15 CN5.27 CN5.33 CN5.39 CN5.45 CN5.51 CN5.57 CN5.71 CN5.73 CN5.76 CN5.77 CN7.9 CN10.3 D1.1 D4.1 D5.1 D6.2 D27.1 D30.1 D31.1 D32.2 D33.1 D36.1 D37.1 D38.2 D43.1(A) FPC8.4 FPC8.7 FPC8.10 FPC8.13 FPC8.16 FPC8.19 FPC8.22 FPC8.23 FPC8.24 P4.1 P4.2 P4.3 P4.4 Q7.2(S) R4.1 R6.1 R7.1 R17.1 R19.1 R20.1 R46.1 R81.1 R82.1 R84.1 R90.1 R104.1 R111.1 R128.1 R129.1 R166.2 SW1.1 SW1.4 U3.4(GND) U3.9(EPAD) U4.4(GND) U4.9(EPAD) U6.3(EM) U8.1(ADDR) U8.3(GND) U10.1(VSS) U12.1 U15.3(EM) U16.3(EM) U17.3(EM) U22.11(VCC-) U25.2(GND) U28.5(GND) U28.10(OE#) U31.3 U31.8 U33.3 U33.8 U45.1(GND) U45.2(GND) U45.7(GND) U45.8(GND) U45.13(GND) U45.14(GND) U45.22(GND) U45.23(GND) U45.32(GND) U45.33(GND) U45.42(GND) U45.43(GND) U45.52(GND) U45.53(GND) U45.59(GND) U45.60(GND) U45.65(GND) U45.66(GND) U45.71(GND) U45.74(GND) U45.98(GND) U46.107(GND) U46.108(GND) U46.113(GND) U46.114(GND) U46.119(GND) U46.120(GND) U46.125(GND) U46.126(GND) U46.131(GND) U46.132(GND) U46.137(GND) U46.138(GND) U46.144(GND) U46.150(GND) U46.155(GND) U46.156(GND) U46.161(GND) U46.162(GND) U46.167(GND) U46.168(GND) U46.173(GND) U46.174(GND) U46.179(GND) U46.180(GND) U46.185(GND) U46.186(GND) U46.191(GND) U46.192(GND) U46.197(GND) U46.198(GND) U48.1 USB7.4(GND) USB7.8(GND) USB7.9(SHELL) USB7.10(SHELL) USB7.11(SHELL) USB7.12(SHELL) USB8.5(GND) USB8.6(EH) X1.2(GND) X1.4(GND) ; also on sheet 8 9 10 11 12
485-A: CN10.1 ; also on sheet 11
485-B: CN10.2 ; also on sheet 11
ADC-SCL: R137.1 U8.10(SCL) U45.28(GPIO13)
ADC-SDA: R138.1 U8.9(SDA) U45.31(GPIO12)
ANALOG-OUT0: C60.1 R110.2 U8.6(AIN2) U22.14(OUT4)
ANALOG-OUT1: C58.1 R103.2 U8.7(AIN3) U22.8(OUT3)
ANALOG-OUT2: C54.1 R89.2 U8.4(AIN0) U22.7(OUT2)
ANALOG_INT: U8.2(ALERT/RDY) U45.29(GPIO16)
C0-: CN10.11 R105.1
C1-: CN10.8 R98.1
C2-: CN10.5 R35.1
CAM1_C_N: FPC8.15 U46.127(CAM1_C_N)
CAM1_C_P: FPC8.14 U46.129(CAM1_C_P)
CAM1_D0_N: FPC8.21 U46.115(CAM1_D0_N)
CAM1_D0_P: FPC8.20 U46.117(CAM1_D0_P)
CAM1_D1_N: FPC8.18 U46.121(CAM1_D1_N)
CAM1_D1_P: FPC8.17 U46.123(CAM1_D1_P)
CAM1_D2_N: FPC8.12 U46.133(CAM1_D2_N)
CAM1_D2_P: FPC8.11 U46.135(CAM1_D2_P)
CAM1_D3_N: FPC8.9 U46.139(CAM1_D3_N)
CAM1_D3_P: FPC8.8 U46.141(CAM1_D3_P)
Camera_GPIO: FPC8.6 U45.97(Camera_GPIO)
ETH_LEDG: U45.15(ETH_nLED3) ; also on sheet 8
ETH_LEDY: U45.17(ETH_nLED2) ; also on sheet 8
ETH_P0_N: U45.10(ETH_P0_N) ; also on sheet 8
ETH_P0_P: U45.12(ETH_P0_P) ; also on sheet 8
ETH_P1_N: U45.6(ETH_P1_N) ; also on sheet 8
ETH_P1_P: U45.4(ETH_P1_P) ; also on sheet 8
ETH_P2_N: U45.9(ETH_P2_N) ; also on sheet 8
ETH_P2_P: U45.11(ETH_P2_P) ; also on sheet 8
ETH_P3_N: U45.5(ETH_P3_N) ; also on sheet 8
ETH_P3_P: U45.3(ETH_P3_P) ; also on sheet 8
GMS_PWR: R81.2 U3.3(EN) U45.26(GPIO19)
GSM_COEX_RX: CN3.62 TP5.1
GSM_COEX_TX: CN3.64 TP6.1
GSM_OFF: CN3.6 R11.2 U45.30(GPIO6)
GSM_RESET: Q7.1(G) R166.1 U45.34(GPIO5)
HDMI0_CEC: U46.151(HDMI0_CEC) ; also on sheet 12
HDMI0_CLK_N: U46.190(HDMI0_CLK_N) ; also on sheet 12
HDMI0_CLK_P: U46.188(HDMI0_CLK_P) ; also on sheet 12
HDMI0_HOTPLUG: U46.153(HDMI0_HOTPLUG) ; also on sheet 12
HDMI0_SCL: U46.200(HDMI0_SCL) ; also on sheet 12
HDMI0_SDA: U46.199(HDMI0_SDA) ; also on sheet 12
HDMI0_TX0_N: U46.184(HDMI0_TX0_N) ; also on sheet 12
HDMI0_TX0_P: U46.182(HDMI0_TX0_P) ; also on sheet 12
HDMI0_TX1_N: U46.178(HDMI0_TX1_N) ; also on sheet 12
HDMI0_TX1_P: U46.176(HDMI0_TX1_P) ; also on sheet 12
HDMI0_TX2_N: U46.172(HDMI0_TX2_N) ; also on sheet 12
HDMI0_TX2_P: U46.170(HDMI0_TX2_P) ; also on sheet 12
HUB_1.8V: C28.1 C29.2 U10.12(VDD18) U10.28(VDD18)
HUB_3.3V: C23.2 C25.2 R47.2 R48.2 R49.2 U10.13(VDD33) U10.21(VDD33) U10.26(OVCRN/SDA)
IN0: R120.1 U6.4(COL) U45.54(GPIO4)
IN0+: CN10.12 D37.2 R105.2 R106.2
IN0-: CN10.10 D38.1 R107.2
IN0-A: CN7.8 R113.1
IN0-C: C47.2 CN7.7 R70.1 U6.2(CAT)
IN1: R119.1 U15.4(COL) U45.50(GPIO17)
IN1+: CN10.9 D31.2 R98.2 R99.2
IN1-: CN10.7 D32.1 R100.2
IN1-A: CN7.6 R114.1
IN1-C: C48.2 CN7.5 R71.1 U15.2(CAT)
IN2: R118.1 U16.4(COL) U45.48(GPIO27)
IN2+: CN10.6 D5.2 R35.2 R85.2
IN2-: CN10.4 D6.1 R86.2
IN2-A: CN7.4 R115.1
IN2-C: C49.2 CN7.3 R72.1 U16.2(CAT)
IN3: R117.1 U17.4(COL) U45.44(GPIO10)
IN3-A: CN7.2 R116.1
IN3-C: C50.2 CN7.1 R73.1 U17.2(CAT)
LED_STATUS: R172.1 U45.24(GPIO26)
NRPIBOOT: SW1.2 SW1.5 U45.93(nRPIBOOT)
OLED-SCL: U45.47(GPIO23) ; also on sheet 10
OLED-SDA: U45.46(GPIO22) ; also on sheet 10
OLED-SW: U45.55(GPIO14) ; also on sheet 10
PCIE_CLK_REQ: CN5.52 U46.102(PCIe_CLK_nREQ)
PCIE_CLP_N: CN5.53 U46.112(PCIe_CLK_N)
PCIE_CLP_P: CN5.55 U46.110(PCIe_CLK_P)
PCIE_R0_N: CN5.41 U46.118(PCIE_RX_N)
PCIE_R0_P: CN5.43 U46.116(PCIe_RX_P)
PCIE_RST: CN5.50 U46.109(PCIe_nRST)
PCIE_T0_N: CN5.47 U46.124(PCIe_TX_N)
PCIE_T0_P: CN5.49 U46.122(PCIe_TX_P)
Pi_nLED_Activity: R126.1 U45.21(Pi_nLED_Activity)
RS485-DI: U45.39(GPIO8) ; also on sheet 11
RS485-RO: U45.40(GPIO9) ; also on sheet 11
RTC-SCL: U45.56(GPIO3) ; also on sheet 10
RTC-SDA: U45.58(GPIO2) ; also on sheet 10
SCL0: FPC8.3 U45.80(SCL0)
SD_CLK: CARD1.5(CLX) U45.57(SD_CLK)
SD_CMD: CARD1.3(CMD) U45.62(SD_CMD)
SD_DAT0: CARD1.7(DAT0) U45.63(SD_DAT0)
SD_DAT1: CARD1.8(DAT1) U45.67(SD_DAT1)
SD_DAT2: CARD1.1(DAT2) U45.69(SD_DAT2)
SD_DAT3: CARD1.2(CD/DAT3) U45.61(SD_DAT3)
SD_PWR_ON: U45.75(SD_PWR_ON)
SDA0: FPC8.2 U45.82(SDA0)
SIM_CLK: CN3.32 R167.2
SIM_DAT: CN3.34 R168.2
SIM_RST: CN3.30 R169.2
SIM_VDD: C45.2 C97.2 CARD2.C1(VCC) CN3.36 R8.2 U33.1 U33.10
U2_N: U28.6(HSD1-) USB8.2(D-)
U2_P: U28.7(HSD1+) USB8.3(D+)
U_N: U10.15(UDM) U28.8(HSD2-)
U_P: U10.16(UDP) U28.9(HSD2+)
USB1_N: U10.10(DM1) U31.2 U31.9 USB7.6(D-)
USB1_P: U10.11(DP1) U31.1 U31.10 USB7.7(D+)
USB2_N: U10.8(DM2) U31.5 U31.6 USB7.2(D-)
USB2_P: U10.9(DP2) U31.4 U31.7 USB7.3(D+)
USB_GSM_N: R171.1 U10.4(DM4)
USB_GSM_P: R170.1 U10.5(DP4)
USB_N: U28.4(D-) U46.103(USB_N)
USB_OTG_ID: R127.1 R128.2 U28.2(Sel) U46.101(USB_OTG_ID)
USB_P: U28.3(D+) U46.105(USB_P)
XI: C26.1 U10.3(XIN) X1.1(OSC1)
XO: C27.2 U10.2(XOUT) X1.3(OSC2)
$1N8083: LED13.1(C) R126.2
$1N18573: LED14.1(C) R172.2
$2N1280: C46.1 U3.2(BOOT)
$2N1329: R82.2 U3.7(RLIM)
$2N1383: C5.2 R4.2
$2N1408: C5.1 U3.6(COMP)
$2N1544: C46.2 L1.1 U3.1(SW)
$2N1552: R5.1 R6.2 U3.5(FB)
$2N2687: CN3.10 LED2.1(C)
$2N2713: LED2.2(A) R10.2
$2N4968: LED8.1(C) R7.2
$2N8134: CN3.67 Q7.3(D) R165.1
$2N8960: C100.2 CARD2.C3(CLK) R167.1 U33.5 U33.6
$2N8973: C101.2 CARD2.C7(I/O) R8.1 R168.1 U33.4 U33.7
$2N8984: C102.2 CARD2.C2(RST) R169.1 U33.2 U33.9
$2N9083: CN3.7 R170.2
$2N9115: CN3.9 R171.2
$3N530: CN5.10 LED9.2(-)
$3N532: LED9.1(+) R13.2
$3N1042: C13.2 U4.2(BOOT)
$3N1044: R84.2 U4.7(RLIM)
$3N1047: C14.2 R17.2
$3N1058: C14.1 U4.6(COMP)
$3N1066: C13.1 L3.1 U4.1(SW)
$3N1070: R18.1 R19.2 U4.5(FB)
$3N3146: R83.2 U4.3(EN)
$3N3320: LED10.1(C) R20.2
$7N483: C53.2 R88.2 R90.2 U22.5(IN2+)
$7N1088: D1.2 D2.1 R86.1 R87.1
$7N1092: D3.1 D4.2 R85.1 R88.1
$7N1189: C54.2 R87.2 R89.1 U22.6(IN2-)
$7N5820: C57.2 R102.2 R104.2 U22.10(IN3+)
$7N5830: D27.2 D28.1 R100.1 R101.1
$7N5831: D29.1 D30.2 R99.1 R102.1
$7N5838: C58.2 R101.2 R103.1 U22.9(IN3-)
$7N6485: C59.2 R109.2 R111.2 U22.12(IN4+)
$7N6495: D33.2 D34.1 R107.1 R108.1
$7N6496: D35.1 D36.2 R106.1 R109.1
$7N6503: C60.2 R108.2 R110.1 U22.13(IN4-)
$8N643: C47.1 R70.2 R113.2 U6.1(AN)
$8N1438: C48.1 R71.2 R114.2 U15.1(AN)
$8N1725: C49.1 R72.2 R115.2 U16.1(AN)
$8N1734: C50.1 R73.2 R116.2 U17.1(AN)
$9N1520: R46.2 U10.14(NC)
$9N1868: R47.1 U10.17(RESET_N)
$9N1871: R48.1 U10.18(NC)
$9N1874: R49.1 U10.19(PSELF)
$9N2998: R127.2 USB8.1(VBUS)
$9N3212: C71.2 U25.1(VOUT) USB7.1(VCC) USB7.5(VCC)
$9N3259: R129.2 U25.3(SET)
$9N3313: R130.2 U25.4(EN)

Not connected (* = marked no-connect by the designer): CARD1 CD; CARD2 C6(VPP); CN3 1 8 20 21 22 23 24 25 26 28 29 31 35 37 38 40 41 42 43 44 46 47 48 49 50 52 53 54 55 56 58 59 60 61 63 66 68 69 75; CN5 1 5 6 7 8 11 13 17 19 20 21 22 23 24 25 26 28 29 30 31 32 34 35 36 37 38 40 42 44 46 48 54 56 58 67 68 69 75; FPC8 5; SW1 3 6; U8 5(AIN1); U10 6(DM3)* 7(DP3)* 22(DRV)* 23(LED1)* 24(LED2)* 25(PWRN)* 27(SCL); U22 1(OUT1) 2(IN1-) 3(IN1+); U45 16(ETH_SYNC_IN)* 18(ETH_SYNC_OUT)* 19(ETH_nLED1)* 20(EEPROM_nWP)* 25(GPIO21)* 27(GPIO20)* 35(ID_SC)* 36(ID_SD)* 37(GPIO7)* 38(GPIO11) 41(GPIO25)* 45(GPIO24)* 49(GPIO18)* 51(GPIO15)* 64(SD_DAT5)* 68(SD_DAT4)* 70(SD_DAT7)* 72(SD_DAT6)* 73(SD_VDD_Override)* 76(RESERVED) 88(CM4_1.8V_O) 89(WL_nDISABLE) 90(CM4_1.8V_O) 91(BT_nDISABLE) 92(RUN_PG) 94(AnalogIP1) 95(PI_LED_nPWR) 96(AnalogIP0) 99(GLOBAL_EN) 100(nEXTRST); U46 104(RESERVED)* 106(RESERVED)* 111(VDAC_COMP) 128(CAM0_D0_N)* 130(CAM0_D0_P)* 134(CAM0_D1_N)* 136(CAM0_D1_P)* 140(CAM0_D_N)* 142(CAM0_C_P)* 143(HDMI1_HOTPLUG) 145(HDMI1_SDA) 146(HDMI1_TX2_P) 147(HDMI1_SCL) 148(HDMI1_TX2_N) 149(HDMI1_CEC) 152(HDMI1_TX1_P) 154(HDMI1_TX1_N) 157(DSI0_D0_N)* 158(HDMI1_TX0_P) 159(DSI0_D0_P)* 160(HDMI1_TX0_N) 163(DSI0_D1_N)* 164(HDMI1_CLK_P) 165(DSI0_D1_P)* 166(HDMI1_CLK_N) 169(DSI0_C_N)* 171(DSI0_C_P)* 175(DSI1_D0_N) 177(DSI1_D0_P) 181(DSI1_D1_N) 183(DSI1_D1_P) 187(DSI1_C_N) 189(DSI1_C_P) 193(DSI1_D2_N) 194(DSI1_D3_N) 195(DSI1_D2_P) 196(DSI1_D3_P); USB8 4(ID)*

## Notes on the sheets
sheet 1
- SD CARD
- BOOT
sheet 2
- 5G MODEM
- Requires differential
  impedance of 90 Ω
- Size !!!
  30x42
  30x52
  RM255C-GL
  SIM8262E-M2
  SIM8260G-M2
- MOUNTING
- https://www.waveshare.com/wiki/SIM8262E-M2_5G_HAT
sheet 5
- Wtyk
  WJ15EDGK-3.81-12P
sheet 6
- PLUG
  XY2500F-G-3.5-10P
sheet 7
- USB SOCKET
- USB HUB
- USB SWITCH NORMAL  / PROGRAMING
